# Altium project HU_revC.PrjPcb (part 2 of 4)

## Sheet RPI_CM5_PINOUT.SchDoc
size C; SheetNumber: 3; SheetTotal: 20
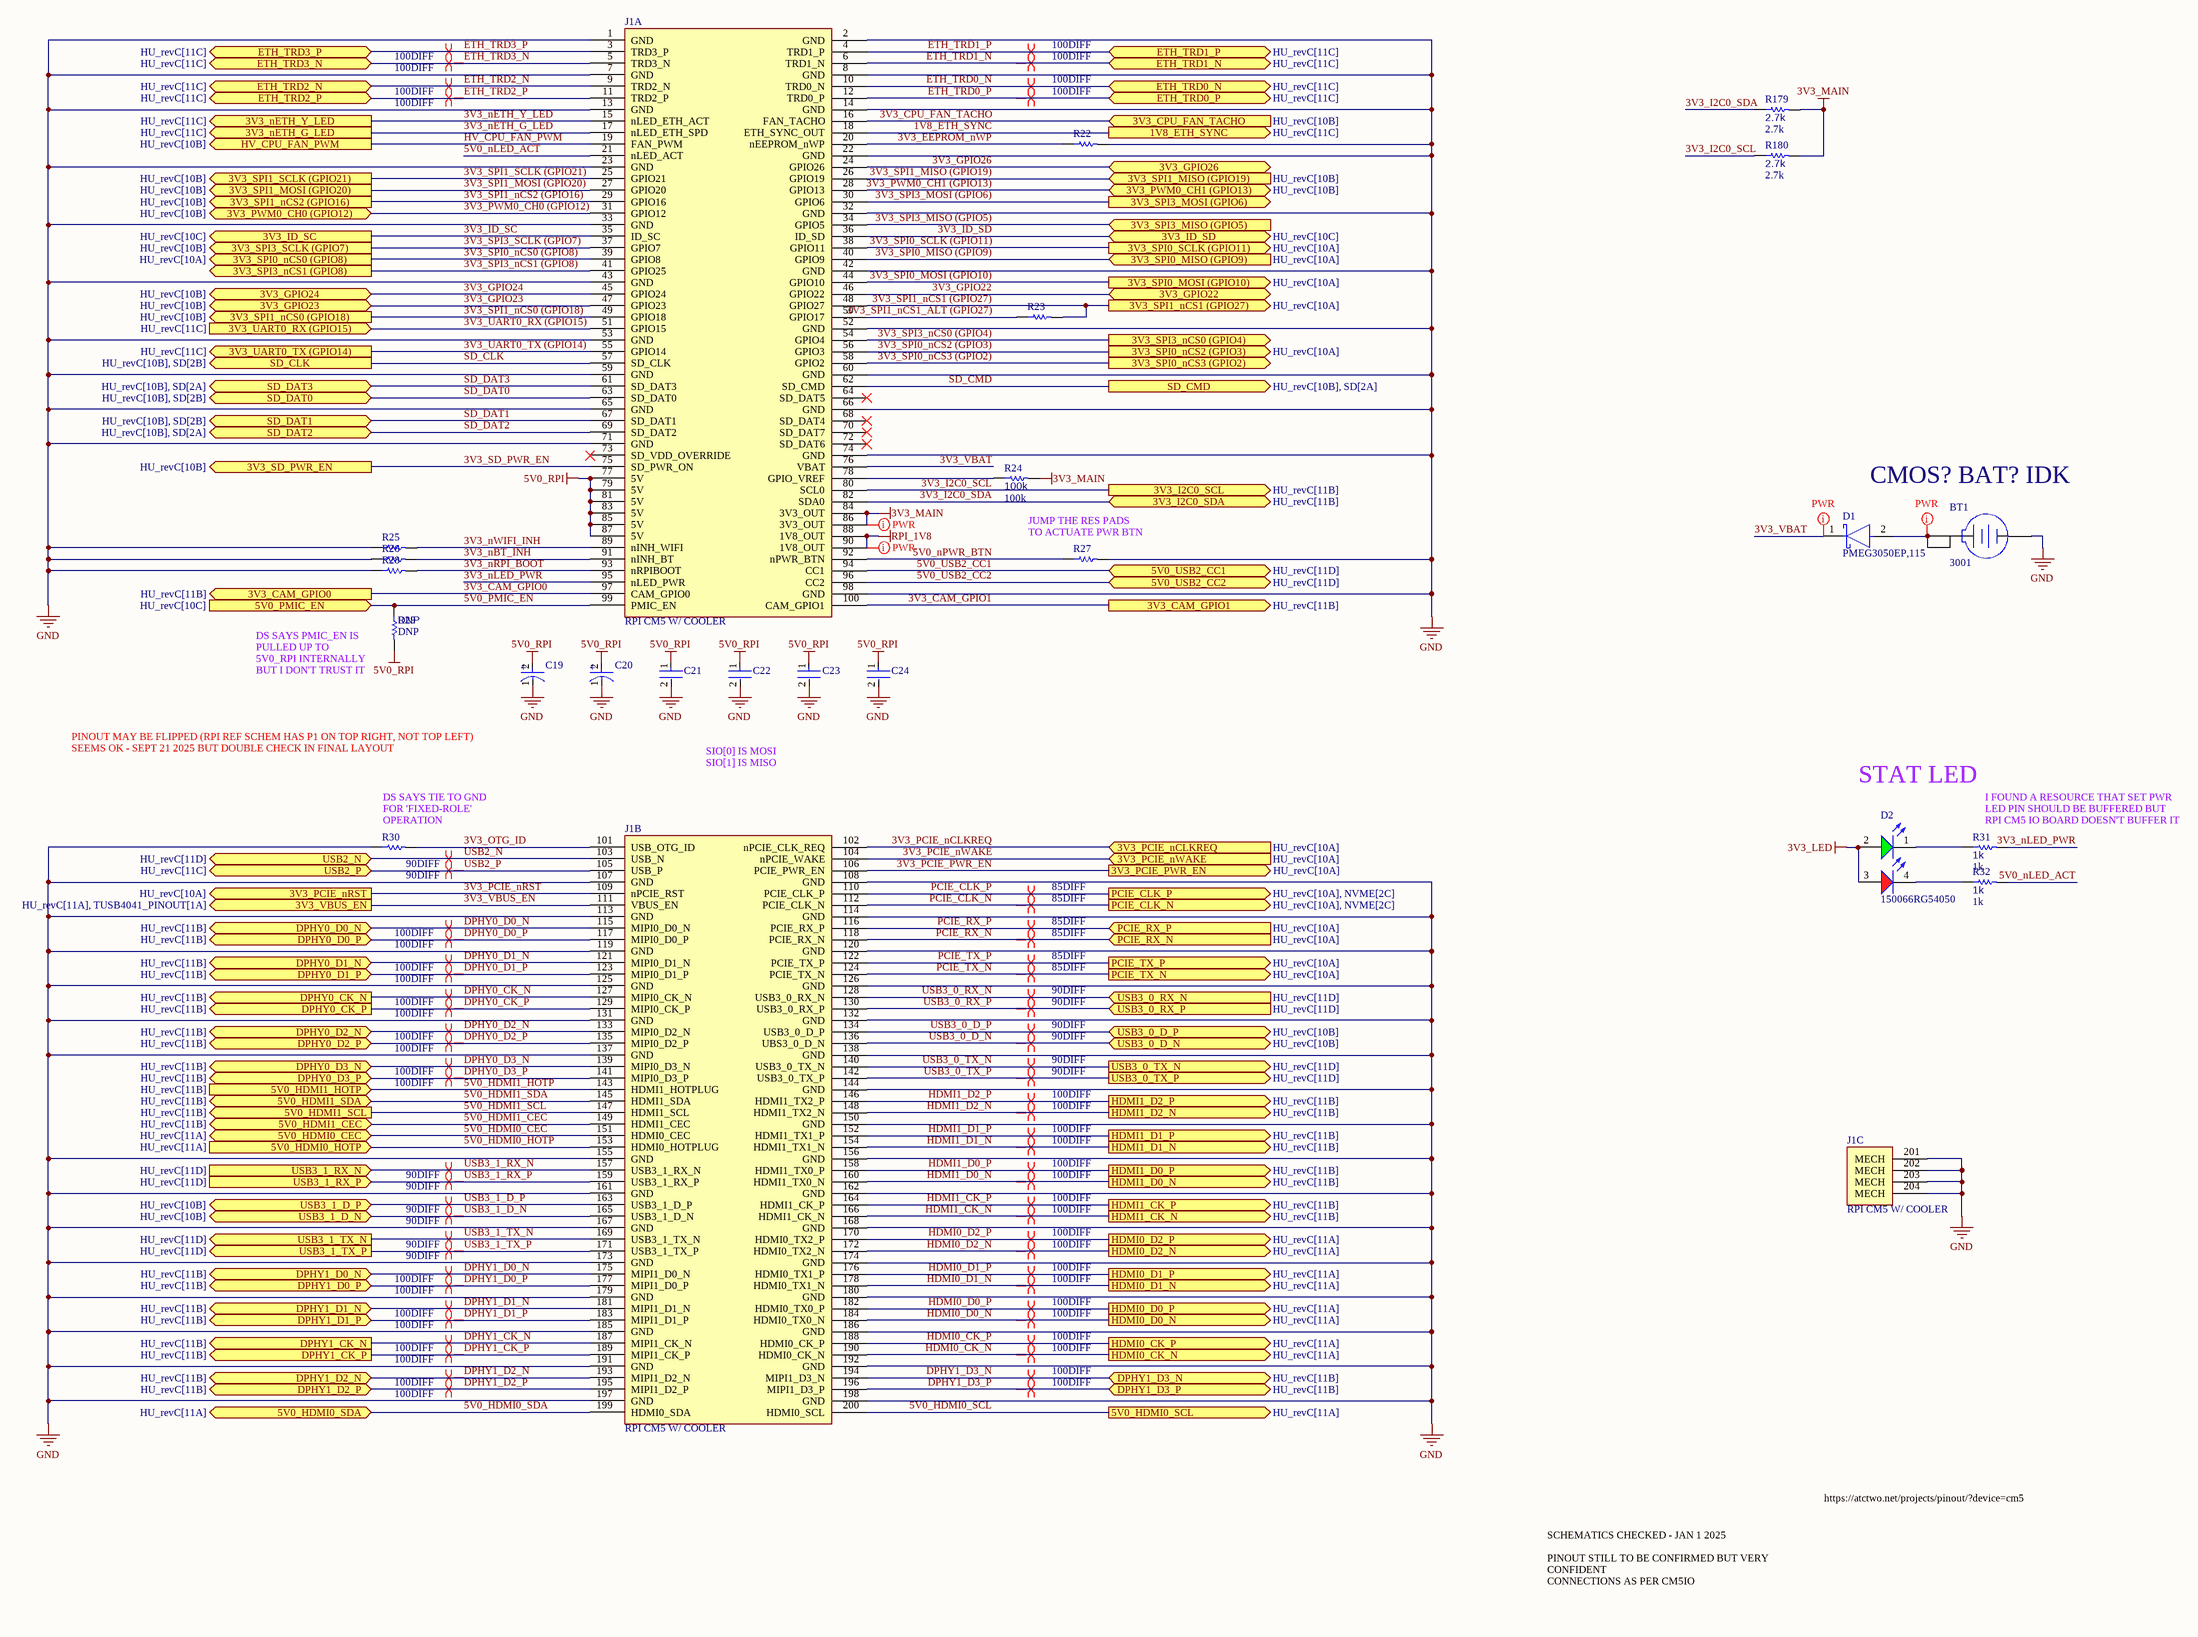
[diagram p7: RPI_CM5_PINOUT.SchDoc]

### Parts
BT1  3001  [KSTN-3001_V]
C19  T491X107K025AT  [FP-T491X107K025AT-MFG]  (value not drawn)
C20  T491X107K025AT  [FP-T491X107K025AT-MFG]  (value not drawn)
C21  C3225X7R1H106M250AC  [FP-C3225-250-0_4-MFG]  (value not drawn)
C22  C3225X7R1H106M250AC  [FP-C3225-250-0_4-MFG]  (value not drawn)
C23  GRM21BR61E226ME44L  [FP-GRM21B-0_2-e0_2_0_7-IPC_B]  (value not drawn)
C24  GRM21BR61E226ME44L  [FP-GRM21B-0_2-e0_2_0_7-IPC_B]  (value not drawn)
D1  PMEG3050EP,115  [FP-SOD128-MFG]
D2  150066RG54050  [WL-SBCD_0606]
J1  RPI CM5 W/ COOLER  [RPI CM5 W_ COOLER-Footprint-1]  (parts A,B,C of 3)
R22  DNP  [RESC1005X40X25ML05T05]  (value not drawn)
R23  DNP  [RESC1005X40X25ML05T05]  (value not drawn)
R24  100k  [R0603B]
R25  DNP  [RESC1005X40X25ML05T05]  (value not drawn)
R26  DNP  [RESC1005X40X25ML05T05]  (value not drawn)
R27  DNP  [RESC1005X40X25ML05T05]  (value not drawn)
R28  DNP  [RESC1005X40X25ML05T05]  (value not drawn)
R29  DNP  [R0603B]
R30  DNP  [RESC1005X40X25ML05T05]  (value not drawn)
R31  1k  [R0603B]
R32  1k  [R0603B]
R179  2.7k  [R0603B]
R180  2.7k  [R0603B]

### Ports
1V8_ETH_SYNC (out, see HU_revC[11C]), 3V3_CAM_GPIO0 (out, see HU_revC[11B]), 3V3_CAM_GPIO1 (out, see HU_revC[11B]), 3V3_CPU_FAN_TACHO (in, see HU_revC[10B]), 3V3_GPIO22 (bidir), 3V3_GPIO23 (bidir, see HU_revC[10B]), 3V3_GPIO24 (bidir, see HU_revC[10B]), 3V3_GPIO26 (bidir), 3V3_I2C0_SCL (out, see HU_revC[11B]), 3V3_I2C0_SDA (bidir, see HU_revC[11B]), 3V3_ID_SC (out, see HU_revC[10C]), 3V3_ID_SD (bidir, see HU_revC[10C]), 3V3_nETH_G_LED (out, see HU_revC[11C]), 3V3_nETH_Y_LED (out, see HU_revC[11C]), 3V3_PCIE_nCLKREQ (in, see HU_revC[10A]), 3V3_PCIE_nRST (out, see HU_revC[10A]), 3V3_PCIE_nWAKE (in, see HU_revC[10A]), 3V3_PCIE_PWR_EN (out, see HU_revC[10A]), 3V3_PWM0_CH0 (GPIO12) (bidir, see HU_revC[10B]), 3V3_PWM0_CH1 (GPIO13) (bidir, see HU_revC[10B]), 3V3_SD_PWR_EN (out, see HU_revC[10B]), 3V3_SPI0_MISO (GPIO9) (in, see HU_revC[10A]), 3V3_SPI0_MOSI (GPIO10) (out, see HU_revC[10A]), 3V3_SPI0_nCS0 (GPIO8) (out, see HU_revC[10A]), 3V3_SPI0_nCS2 (GPIO3) (out, see HU_revC[10A]), 3V3_SPI0_nCS3 (GPIO2) (out), 3V3_SPI0_SCLK (GPIO11) (out, see HU_revC[10A]), 3V3_SPI1_MISO (GPIO19) (in, see HU_revC[10B]), 3V3_SPI1_MOSI (GPIO20) (out, see HU_revC[10B]), 3V3_SPI1_nCS0 (GPIO18) (out, see HU_revC[10B]), 3V3_SPI1_nCS1 (GPIO27) (out, see HU_revC[10A]), 3V3_SPI1_nCS2 (GPIO16) (out, see HU_revC[10B]), 3V3_SPI1_SCLK (GPIO21) (out, see HU_revC[10B]), 3V3_SPI3_MISO (GPIO5) (in), 3V3_SPI3_MOSI (GPIO6) (out), 3V3_SPI3_nCS0 (GPIO4) (out), 3V3_SPI3_nCS1 (GPIO8) (out), 3V3_SPI3_SCLK (GPIO7) (out, see HU_revC[10B]), 3V3_UART0_RX (GPIO15) (in, see HU_revC[11C]), 3V3_UART0_TX (GPIO14) (out, see HU_revC[11C]), 3V3_VBUS_EN (out, see HU_revC[11A], TUSB4041_PINOUT[1A]), 5V0_HDMI0_CEC (bidir, see HU_revC[11A]), 5V0_HDMI0_HOTP (in, see HU_revC[11A]), 5V0_HDMI0_SCL (out, see HU_revC[11A]), 5V0_HDMI0_SDA (bidir, see HU_revC[11A]), 5V0_HDMI1_CEC (bidir, see HU_revC[11B]), 5V0_HDMI1_HOTP (in, see HU_revC[11B]), 5V0_HDMI1_SCL (out, see HU_revC[11B]), 5V0_HDMI1_SDA (bidir, see HU_revC[11B]), 5V0_PMIC_EN (in, see HU_revC[10C]), 5V0_USB2_CC1 (bidir, see HU_revC[11D]), 5V0_USB2_CC2 (bidir, see HU_revC[11D]), DPHY0_CK_N (out, see HU_revC[11B]), DPHY0_CK_P (out, see HU_revC[11B]), DPHY0_D0_N (bidir, see HU_revC[11B]), DPHY0_D0_P (bidir, see HU_revC[11B]), DPHY0_D1_N (bidir, see HU_revC[11B]), DPHY0_D1_P (bidir, see HU_revC[11B]), DPHY0_D2_N (bidir, see HU_revC[11B]), DPHY0_D2_P (bidir, see HU_revC[11B]), DPHY0_D3_N (bidir, see HU_revC[11B]), DPHY0_D3_P (bidir, see HU_revC[11B]), DPHY1_CK_N (out, see HU_revC[11B]), DPHY1_CK_P (out, see HU_revC[11B]), DPHY1_D0_N (bidir, see HU_revC[11B]), DPHY1_D0_P (bidir, see HU_revC[11B]), DPHY1_D1_N (bidir, see HU_revC[11B]), DPHY1_D1_P (bidir, see HU_revC[11B]), DPHY1_D2_N (bidir, see HU_revC[11B]), DPHY1_D2_P (bidir, see HU_revC[11B]), DPHY1_D3_N (bidir, see HU_revC[11B]), DPHY1_D3_P (bidir, see HU_revC[11B]), ETH_TRD0_N (bidir, see HU_revC[11C]), ETH_TRD0_P (bidir, see HU_revC[11C]), ETH_TRD1_N (bidir, see HU_revC[11C]), ETH_TRD1_P (bidir, see HU_revC[11C]), ETH_TRD2_N (bidir, see HU_revC[11C]), ETH_TRD2_P (bidir, see HU_revC[11C]), ETH_TRD3_N (bidir, see HU_revC[11C]), ETH_TRD3_P (bidir, see HU_revC[11C]), HDMI0_CK_N (out, see HU_revC[11A]), HDMI0_CK_P (out, see HU_revC[11A]), HDMI0_D0_N (out, see HU_revC[11A]), HDMI0_D0_P (out, see HU_revC[11A]), HDMI0_D1_N (out, see HU_revC[11A]), HDMI0_D1_P (out, see HU_revC[11A]), HDMI0_D2_N (out, see HU_revC[11A]), HDMI0_D2_P (out, see HU_revC[11A]), HDMI1_CK_N (out, see HU_revC[11B]), HDMI1_CK_P (out, see HU_revC[11B]), HDMI1_D0_N (out, see HU_revC[11B]), HDMI1_D0_P (out, see HU_revC[11B]), HDMI1_D1_N (out, see HU_revC[11B]), HDMI1_D1_P (out, see HU_revC[11B]), HDMI1_D2_N (out, see HU_revC[11B]), HDMI1_D2_P (out, see HU_revC[11B]), HV_CPU_FAN_PWM (out, see HU_revC[10B]), PCIE_CLK_N (out, see HU_revC[10A], NVME[2C]), PCIE_CLK_P (out, see HU_revC[10A], NVME[2C]), PCIE_RX_N (in, see HU_revC[10A]), PCIE_RX_P (in, see HU_revC[10A]), PCIE_TX_N (out, see HU_revC[10A]), PCIE_TX_P (out, see HU_revC[10A]), SD_CLK (out, see HU_revC[10B], SD[2B]), SD_CMD (out, see HU_revC[10B], SD[2A]), SD_DAT0 (bidir, see HU_revC[10B], SD[2B]), SD_DAT1 (bidir, see HU_revC[10B], SD[2B]), SD_DAT2 (bidir, see HU_revC[10B], SD[2A]), SD_DAT3 (bidir, see HU_revC[10B], SD[2A]), USB2_N (bidir, see HU_revC[11D]), USB2_P (bidir, see HU_revC[11C]), USB3_0_D_N (bidir, see HU_revC[10B]), USB3_0_D_P (bidir, see HU_revC[10B]), USB3_0_RX_N (in, see HU_revC[11D]), USB3_0_RX_P (in, see HU_revC[11D]), USB3_0_TX_N (out, see HU_revC[11D]), USB3_0_TX_P (out, see HU_revC[11D]), USB3_1_D_N (bidir, see HU_revC[10B]), USB3_1_D_P (bidir, see HU_revC[10B]), USB3_1_RX_N (in, see HU_revC[11D]), USB3_1_RX_P (in, see HU_revC[11D]), USB3_1_TX_N (out, see HU_revC[11D]), USB3_1_TX_P (out, see HU_revC[11D])

### Nets
3V3_LED: D2.2(A) D2.3(A)
3V3_MAIN: J1.84(3V3_OUT) J1.86(3V3_OUT) R24.2 R179.2 R180.2
5V0_RPI: C19.2(A) C20.2(A) C21.1 C22.1 C23.1 C24.1 J1.77(5V) J1.79(5V) J1.81(5V) J1.83(5V) J1.85(5V) J1.87(5V) R29.2
GND: BT1.3(-) C19.1(C) C20.1(C) C21.2 C22.2 C23.2 C24.2 J1.1(GND) J1.2(GND) J1.7(GND) J1.8(GND) J1.13(GND) J1.14(GND) J1.22(GND) J1.23(GND) J1.32(GND) J1.33(GND) J1.42(GND) J1.43(GND) J1.52(GND) J1.53(GND) J1.59(GND) J1.60(GND) J1.65(GND) J1.66(GND) J1.71(GND) J1.74(GND) J1.98(GND) J1.107(GND) J1.108(GND) J1.113(GND) J1.114(GND) J1.119(GND) J1.120(GND) J1.125(GND) J1.126(GND) J1.131(GND) J1.132(GND) J1.137(GND) J1.138(GND) J1.144(GND) J1.150(GND) J1.155(GND) J1.156(GND) J1.161(GND) J1.162(GND) J1.167(GND) J1.168(GND) J1.173(GND) J1.174(GND) J1.179(GND) J1.180(GND) J1.185(GND) J1.186(GND) J1.191(GND) J1.192(GND) J1.197(GND) J1.198(GND) J1.201(MECH) J1.202(MECH) J1.203(MECH) J1.204(MECH) R22.2 R25.1 R26.1 R27.2 R28.1 R30.1
RPI_1V8: J1.88(1V8_OUT) J1.90(1V8_OUT)
1V8_ETH_SYNC: J1.18(ETH_SYNC_OUT) ; port 1V8_ETH_SYNC
3V3_CAM_GPIO0: J1.97(CAM_GPIO0) ; port 3V3_CAM_GPIO0
3V3_CAM_GPIO1: J1.100(CAM_GPIO1) ; port 3V3_CAM_GPIO1
3V3_CPU_FAN_TACHO: J1.16(FAN_TACHO) ; port 3V3_CPU_FAN_TACHO
3V3_EEPROM_nWP: J1.20(nEEPROM_nWP) R22.1
3V3_GPIO22: J1.46(GPIO22) ; port 3V3_GPIO22
3V3_GPIO23: J1.47(GPIO23) ; port 3V3_GPIO23  [project net 3V3_CAR_VCC_INH]
3V3_GPIO24: J1.45(GPIO24) ; port 3V3_GPIO24
3V3_GPIO26: J1.24(GPIO26) ; port 3V3_GPIO26
3V3_I2C0_SCL: J1.80(SCL0) R180.1 ; port 3V3_I2C0_SCL
3V3_I2C0_SDA: J1.82(SDA0) R179.1 ; port 3V3_I2C0_SDA
3V3_ID_SC: J1.35(ID_SC) ; port 3V3_ID_SC
3V3_ID_SD: J1.36(ID_SD) ; port 3V3_ID_SD
3V3_nBT_INH: J1.91(nINH_BT) R26.2
3V3_nETH_G_LED: J1.17(nLED_ETH_SPD) ; port 3V3_nETH_G_LED
3V3_nETH_Y_LED: J1.15(nLED_ETH_ACT) ; port 3V3_nETH_Y_LED
3V3_nLED_PWR: J1.95(nLED_PWR) R31.2
3V3_nRPI_BOOT: J1.93(nRPIBOOT) R28.2
3V3_nWIFI_INH: J1.89(nINH_WIFI) R25.2
3V3_OTG_ID: J1.101(USB_OTG_ID) R30.2
3V3_PCIE_nCLKREQ: J1.102(nPCIE_CLK_REQ) ; port 3V3_PCIE_nCLKREQ
3V3_PCIE_nRST: J1.109(nPCIE_RST) ; port 3V3_PCIE_nRST
3V3_PCIE_nWAKE: J1.104(nPCIE_WAKE) ; port 3V3_PCIE_nWAKE
3V3_PCIE_PWR_EN: J1.106(PCIE_PWR_EN) ; port 3V3_PCIE_PWR_EN
3V3_PWM0_CH0 (GPIO12): J1.31(GPIO12) ; port 3V3_PWM0_CH0 (GPIO12)
3V3_PWM0_CH1 (GPIO13): J1.28(GPIO13) ; port 3V3_PWM0_CH1 (GPIO13)
3V3_SD_PWR_EN: J1.75(SD_PWR_ON) ; port 3V3_SD_PWR_EN
3V3_SPI0_MISO (GPIO9): J1.40(GPIO9) ; port 3V3_SPI0_MISO (GPIO9)
3V3_SPI0_MOSI (GPIO10): J1.44(GPIO10) ; port 3V3_SPI0_MOSI (GPIO10)
3V3_SPI0_nCS0 (GPIO8): J1.39(GPIO8) ; port 3V3_SPI0_nCS0 (GPIO8)
3V3_SPI0_nCS2 (GPIO3): J1.56(GPIO3) ; port 3V3_SPI0_nCS2 (GPIO3)
3V3_SPI0_nCS3 (GPIO2): J1.58(GPIO2) ; port 3V3_SPI0_nCS3 (GPIO2)  [project net 3V3_AMP_PWR_EN]
3V3_SPI0_SCLK (GPIO11): J1.38(GPIO11) ; port 3V3_SPI0_SCLK (GPIO11)
3V3_SPI1_MISO (GPIO19): J1.26(GPIO19) ; port 3V3_SPI1_MISO (GPIO19)
3V3_SPI1_MOSI (GPIO20): J1.27(GPIO20) ; port 3V3_SPI1_MOSI (GPIO20)
3V3_SPI1_nCS0 (GPIO18): J1.49(GPIO18) ; port 3V3_SPI1_nCS0 (GPIO18)
3V3_SPI1_nCS1 (GPIO27): J1.48(GPIO27) R23.2 ; port 3V3_SPI1_nCS1 (GPIO27)
3V3_SPI1_nCS1_ALT (GPIO27): J1.50(GPIO17) R23.1
3V3_SPI1_nCS2 (GPIO16): J1.29(GPIO16) ; port 3V3_SPI1_nCS2 (GPIO16)
3V3_SPI1_SCLK (GPIO21): J1.25(GPIO21) ; port 3V3_SPI1_SCLK (GPIO21)
3V3_SPI3_MISO (GPIO5): J1.34(GPIO5) ; port 3V3_SPI3_MISO (GPIO5)
3V3_SPI3_MOSI (GPIO6): J1.30(GPIO6) ; port 3V3_SPI3_MOSI (GPIO6)
3V3_SPI3_nCS0 (GPIO4): J1.54(GPIO4) ; port 3V3_SPI3_nCS0 (GPIO4)
3V3_SPI3_nCS1 (GPIO8): J1.41(GPIO25) ; port 3V3_SPI3_nCS1 (GPIO8)
3V3_SPI3_SCLK (GPIO7): J1.37(GPIO7) ; port 3V3_SPI3_SCLK (GPIO7)
3V3_UART0_RX (GPIO15): J1.51(GPIO15) ; port 3V3_UART0_RX (GPIO15)
3V3_UART0_TX (GPIO14): J1.55(GPIO14) ; port 3V3_UART0_TX (GPIO14)
3V3_VBAT: D1.1(C) J1.76(VBAT)
3V3_VBUS_EN: J1.111(VBUS_EN) ; port 3V3_VBUS_EN
5V0_HDMI0_CEC: J1.151(HDMI0_CEC) ; port 5V0_HDMI0_CEC
5V0_HDMI0_HOTP: J1.153(HDMI0_HOTPLUG) ; port 5V0_HDMI0_HOTP
5V0_HDMI0_SCL: J1.200(HDMI0_SCL) ; port 5V0_HDMI0_SCL
5V0_HDMI0_SDA: J1.199(HDMI0_SDA) ; port 5V0_HDMI0_SDA
5V0_HDMI1_CEC: J1.149(HDMI1_CEC) ; port 5V0_HDMI1_CEC
5V0_HDMI1_HOTP: J1.143(HDMI1_HOTPLUG) ; port 5V0_HDMI1_HOTP
5V0_HDMI1_SCL: J1.147(HDMI1_SCL) ; port 5V0_HDMI1_SCL
5V0_HDMI1_SDA: J1.145(HDMI1_SDA) ; port 5V0_HDMI1_SDA
5V0_nLED_ACT: J1.21(nLED_ACT) R32.2
5V0_nPWR_BTN: J1.92(nPWR_BTN) R27.1
5V0_PMIC_EN: J1.99(PMIC_EN) R29.1 ; port 5V0_PMIC_EN
5V0_USB2_CC1: J1.94(CC1) ; port 5V0_USB2_CC1
5V0_USB2_CC2: J1.96(CC2) ; port 5V0_USB2_CC2
DPHY0_CK_N: J1.127(MIPI0_CK_N) ; port DPHY0_CK_N
DPHY0_CK_P: J1.129(MIPI0_CK_P) ; port DPHY0_CK_P
DPHY0_D0_N: J1.115(MIPI0_D0_N) ; port DPHY0_D0_N
DPHY0_D0_P: J1.117(MIPI0_D0_P) ; port DPHY0_D0_P
DPHY0_D1_N: J1.121(MIPI0_D1_N) ; port DPHY0_D1_N
DPHY0_D1_P: J1.123(MIPI0_D1_P) ; port DPHY0_D1_P
DPHY0_D2_N: J1.133(MIPI0_D2_N) ; port DPHY0_D2_N
DPHY0_D2_P: J1.135(MIPI0_D2_P) ; port DPHY0_D2_P
DPHY0_D3_N: J1.139(MIPI0_D3_N) ; port DPHY0_D3_N
DPHY0_D3_P: J1.141(MIPI0_D3_P) ; port DPHY0_D3_P
DPHY1_CK_N: J1.187(MIPI1_CK_N) ; port DPHY1_CK_N
DPHY1_CK_P: J1.189(MIPI1_CK_P) ; port DPHY1_CK_P
DPHY1_D0_N: J1.175(MIPI1_D0_N) ; port DPHY1_D0_N
DPHY1_D0_P: J1.177(MIPI1_D0_P) ; port DPHY1_D0_P
DPHY1_D1_N: J1.181(MIPI1_D1_N) ; port DPHY1_D1_N
DPHY1_D1_P: J1.183(MIPI1_D1_P) ; port DPHY1_D1_P
DPHY1_D2_N: J1.193(MIPI1_D2_N) ; port DPHY1_D2_N
DPHY1_D2_P: J1.195(MIPI1_D2_P) ; port DPHY1_D2_P
DPHY1_D3_N: J1.194(MIPI1_D3_N) ; port DPHY1_D3_N
DPHY1_D3_P: J1.196(MIPI1_D3_P) ; port DPHY1_D3_P
ETH_TRD0_N: J1.10(TRD0_N) ; port ETH_TRD0_N
ETH_TRD0_P: J1.12(TRD0_P) ; port ETH_TRD0_P
ETH_TRD1_N: J1.6(TRD1_N) ; port ETH_TRD1_N
ETH_TRD1_P: J1.4(TRD1_P) ; port ETH_TRD1_P
ETH_TRD2_N: J1.9(TRD2_N) ; port ETH_TRD2_N
ETH_TRD2_P: J1.11(TRD2_P) ; port ETH_TRD2_P
ETH_TRD3_N: J1.5(TRD3_N) ; port ETH_TRD3_N
ETH_TRD3_P: J1.3(TRD3_P) ; port ETH_TRD3_P
HDMI0_CK_N: J1.190(HDMI0_CK_N) ; port HDMI0_CK_N
HDMI0_CK_P: J1.188(HDMI0_CK_P) ; port HDMI0_CK_P
HDMI0_D0_N: J1.184(HDMI0_TX0_N) ; port HDMI0_D0_N
HDMI0_D0_P: J1.182(HDMI0_TX0_P) ; port HDMI0_D0_P
HDMI0_D1_N: J1.178(HDMI0_TX1_N) ; port HDMI0_D1_N
HDMI0_D1_P: J1.176(HDMI0_TX1_P) ; port HDMI0_D1_P
HDMI0_D2_N: J1.172(HDMI0_TX2_N) ; port HDMI0_D2_N
HDMI0_D2_P: J1.170(HDMI0_TX2_P) ; port HDMI0_D2_P
HDMI1_CK_N: J1.166(HDMI1_CK_N) ; port HDMI1_CK_N
HDMI1_CK_P: J1.164(HDMI1_CK_P) ; port HDMI1_CK_P
HDMI1_D0_N: J1.160(HDMI1_TX0_N) ; port HDMI1_D0_N
HDMI1_D0_P: J1.158(HDMI1_TX0_P) ; port HDMI1_D0_P
HDMI1_D1_N: J1.154(HDMI1_TX1_N) ; port HDMI1_D1_N
HDMI1_D1_P: J1.152(HDMI1_TX1_P) ; port HDMI1_D1_P
HDMI1_D2_N: J1.148(HDMI1_TX2_N) ; port HDMI1_D2_N
HDMI1_D2_P: J1.146(HDMI1_TX2_P) ; port HDMI1_D2_P
HV_CPU_FAN_PWM: J1.19(FAN_PWM) ; port HV_CPU_FAN_PWM
PCIE_CLK_N: J1.112(PCIE_CLK_N) ; port PCIE_CLK_N
PCIE_CLK_P: J1.110(PCIE_CLK_P) ; port PCIE_CLK_P
PCIE_RX_N: J1.118(PCIE_RX_N) ; port PCIE_RX_N
PCIE_RX_P: J1.116(PCIE_RX_P) ; port PCIE_RX_P
PCIE_TX_N: J1.124(PCIE_TX_N) ; port PCIE_TX_N
PCIE_TX_P: J1.122(PCIE_TX_P) ; port PCIE_TX_P
SD_CLK: J1.57(SD_CLK) ; port SD_CLK
SD_CMD: J1.62(SD_CMD) ; port SD_CMD
SD_DAT0: J1.63(SD_DAT0) ; port SD_DAT0
SD_DAT1: J1.67(SD_DAT1) ; port SD_DAT1
SD_DAT2: J1.69(SD_DAT2) ; port SD_DAT2
SD_DAT3: J1.61(SD_DAT3) ; port SD_DAT3
USB2_N: J1.103(USB_N) ; port USB2_N  [project net PRE_RC_DBG_USB_N]
USB2_P: J1.105(USB_P) ; port USB2_P  [project net PRE_RC_DBG_USB_P]
USB3_0_D_N: J1.136(UBS3_0_D_N) ; port USB3_0_D_N
USB3_0_D_P: J1.134(USB3_0_D_P) ; port USB3_0_D_P
USB3_0_RX_N: J1.128(USB3_0_RX_N) ; port USB3_0_RX_N
USB3_0_RX_P: J1.130(USB3_0_RX_P) ; port USB3_0_RX_P
USB3_0_TX_N: J1.140(USB3_0_TX_N) ; port USB3_0_TX_N
USB3_0_TX_P: J1.142(USB3_0_TX_P) ; port USB3_0_TX_P
USB3_1_D_N: J1.165(USB3_1_D_N) ; port USB3_1_D_N
USB3_1_D_P: J1.163(USB3_1_D_P) ; port USB3_1_D_P
USB3_1_RX_N: J1.157(USB3_1_RX_N) ; port USB3_1_RX_N
USB3_1_RX_P: J1.159(USB3_1_RX_P) ; port USB3_1_RX_P
USB3_1_TX_N: J1.169(USB3_1_TX_N) ; port USB3_1_TX_N
USB3_1_TX_P: J1.171(USB3_1_TX_P) ; port USB3_1_TX_P
NetBT1_1: BT1.1(+) BT1.2(+) D1.2(A)
NetD2_1: D2.1(K) R31.1
NetD2_4: D2.4(K) R32.1
NetJ1_78: J1.78(GPIO_VREF) R24.1

Not connected (* = marked no-connect by the designer): J1 64(SD_DAT5)* 68(SD_DAT4)* 70(SD_DAT7)* 72(SD_DAT6)* 73(SD_VDD_OVERRIDE)*

### Layout directives
net class PWR: 3V3_MAIN, 3V3_VBAT, NetBT1_1, RPI_1V8
differential pair; differential pair class 100DIFF: DPHY0_CK_N, DPHY0_CK_P, DPHY0_D0_N, DPHY0_D0_P, DPHY0_D1_N, DPHY0_D1_P, DPHY0_D2_N, DPHY0_D2_P, DPHY0_D3_N, DPHY0_D3_P, DPHY1_CK_N, DPHY1_CK_P, DPHY1_D0_N, DPHY1_D0_P, DPHY1_D1_N, DPHY1_D1_P, DPHY1_D2_N, DPHY1_D2_P, DPHY1_D3_N, DPHY1_D3_P, ETH_TRD0_N, ETH_TRD0_P, ETH_TRD1_N, ETH_TRD1_P, ETH_TRD2_N, ETH_TRD2_P, ETH_TRD3_N, ETH_TRD3_P, HDMI0_CK_N, HDMI0_CK_P, HDMI0_D0_N, HDMI0_D0_P, HDMI0_D1_N, HDMI0_D1_P, HDMI0_D2_N, HDMI0_D2_P, HDMI1_CK_N, HDMI1_CK_P, HDMI1_D0_N, HDMI1_D0_P, HDMI1_D1_N, HDMI1_D1_P, HDMI1_D2_N, HDMI1_D2_P
differential pair; differential pair class 90DIFF: PRE_RC_DBG_USB_N, PRE_RC_DBG_USB_P, USB3_0_D_N, USB3_0_D_P, USB3_0_RX_N, USB3_0_RX_P, USB3_0_TX_N, USB3_0_TX_P, USB3_1_D_N, USB3_1_D_P, USB3_1_RX_N, USB3_1_RX_P, USB3_1_TX_N, USB3_1_TX_P
differential pair; differential pair class 85DIFF: PCIE_CLK_N, PCIE_CLK_P, PCIE_RX_N, PCIE_RX_P, PCIE_TX_N, PCIE_TX_P

### Notes on the sheet
- CMOS? BAT? IDK
- JUMP THE RES PADS TO ACTUATE PWR BTN
- (near R29) DS SAYS PMIC_EN IS PULLED UP TO 5V0_RPI INTERNALLY BUT I DON'T TRUST IT
- PINOUT MAY BE FLIPPED (RPI REF SCHEM HAS P1 ON TOP RIGHT, NOT TOP LEFT)
- SEEMS OK - SEPT 21 2025 BUT DOUBLE CHECK IN FINAL LAYOUT
- SIO[0] IS MOSI
  SIO[1] IS MISO
- STAT LED
- (near R30) DS SAYS TIE TO GND FOR 'FIXED-ROLE' OPERATION
- (near R31) I FOUND A RESOURCE THAT SET PWR LED PIN SHOULD BE BUFFERED BUT RPI CM5 IO BOARD DOESN'T BUFFER IT
- https://atctwo.net/projects/pinout/?device=cm5
- SCHEMATICS CHECKED - JAN 1 2025
  PINOUT STILL TO BE CONFIRMED BUT VERY CONFIDENT
  CONNECTIONS AS PER CM5IO
- (in symbol CMP-2000-07204-2) +

### Library data of the parts
BT1 = CMP-2000-05463-1: Holder Battery Coin, 12 mm, 2-Pin THD, RoHS; Manufacturer: Keystone; Package Reference: 3001; Package Description: 2-Pin Through Hole Device, Body 13.21 x 12.07 mm; Datasheet Version: Rev. H, 09/2006; Datasheet URL: https://datasheet.ciiva.com/3/3001-3954.pdf; Mounting Technology: ThroughHole; Manufacturer URL: http://www.keyelco.com/
C19 C20 = CMP-2000-07204-2: CAP TANT 100UF 10% 25V 2917; Leakage Current: 25uA; Ripple Current: 742mA; Polarity: Polar; Dissipation Factor: 8%; Life (Hours): 2000Hour; Dielectric Material: Tantalum; ESR (Equivalent Series Resistance): 300mR; Length: 7.3mm; RoHS Compliant: No; Failure Rate: 0.001%; REACH SVHC: No SVHC; Tolerance: 10%; Mount: Surface Mount; Height - Seated (Max): 0.169inch; Features: General Purpose; Height: 4mm; Package Quantity: 1; Case Code (Metric): 7343; Max Operating Temperature: 125°C; Number of Pins: 2; Radiation Hardening: No; Lead Free: Lead Free; Capacitance: 100uF; Termination: SMD/SMT; Voltage Rating: 25V; Series: T491; Depth: 4.3mm; Construction: Flat; Case/Package: 2917; Min Operating Temperature: -55°C; Voltage Rating (DC): 25V; Width: 4.3mm; Packaging: Tape and Reel; Case Code (Imperial): 2917; Voltage: 25V
C21 C22 = CMP-08246-002653-1: Multilayer Ceramic Capacitors 10uF ±20% 50V X7R SMD 1210; Width: 0.098inch; Package Quantity: 1000; Height: 2.5mm; Dielectric Material: Ceramic; Voltage Rating: 50V; Series: C; Capacitance: 10uF; Tolerance: 20%; Weight: 0.000564oz; Case/Package: 1210; Case Code (Imperial): 1210; Dielectric: X7R; Case Code (Metric): 3225; REACH SVHC: No SVHC; Packaging: Tape and Reel; Length: 0.126inch; Termination: SMD/SMT; Min Operating Temperature: -55°C; Voltage Rating (DC): 50V; Lead Free: Lead Free; Max Operating Temperature: 125°C; Thickness: 0.11inch; Mount: Surface Mount
C23 C24 = CMP-2007-03222-3: Chip Multilayer Ceramic Capacitors for General Purpose, 0805, 22uF, X5R, 15%, 20%, 25V; Case/Package: 0805; Depth: 1.25mm; Resistor Type: Ceramic; Voltage Rating: 25V; Lead Free: Lead Free; Voltage Rating (DC): 25V; Case Code (Metric): 2012; Thickness: 0.057inch; REACH SVHC: No SVHC; Material: Ceramic; Tolerance: 20%; Length: 2mm; Capacitance: 22uF; Case Code (Imperial): 0805; Max Operating Temperature: 85°C; Termination: SMD/SMT; Weight: 0.000335oz; Dielectric: X5R; Packaging: Tape and Reel; Voltage: 25V; Package Quantity: 3000; Height: 1.25mm; Mount: Surface Mount; Width: 1.25mm; Min Operating Temperature: -55°C
D1 = CMP-14398-000051-1: DIODE SCHOTTKY 30V 5A SOD128; RoHS Compliant: Yes
D2 = CMP-004-00040-2: Led, Red/Grn, 180Mcd/230Mcd, 624Nm/525Nm Rohs Compliant: Yes; Source: rgled.SchLib; Component Type: Standard; Pins: 4; Design Item ID: CMP-004-00034-2
J1 = CMP-00028-00005-4: Mechanical placeholder for RPI CM5 w/ active cooler on it
R22 R23 R25-R28 R30 = CMP-009-00118-2: READ THE NAME; Pins: 2; Component Type: Standard; Design Item ID: CMP-009-00206-2; Source: 0402jump.SchLib
R24 R29 R31 R32 R179 R180 = CMP-009-00002-14: Resistor
  R24: Value: 100k
  R29: Value: DNP
  R31 R32: Value: 1k
  R179 R180: Value: 2.7k

## Sheet 5V0_REG.SchDoc
size C; SheetNumber: 4; SheetTotal: 20
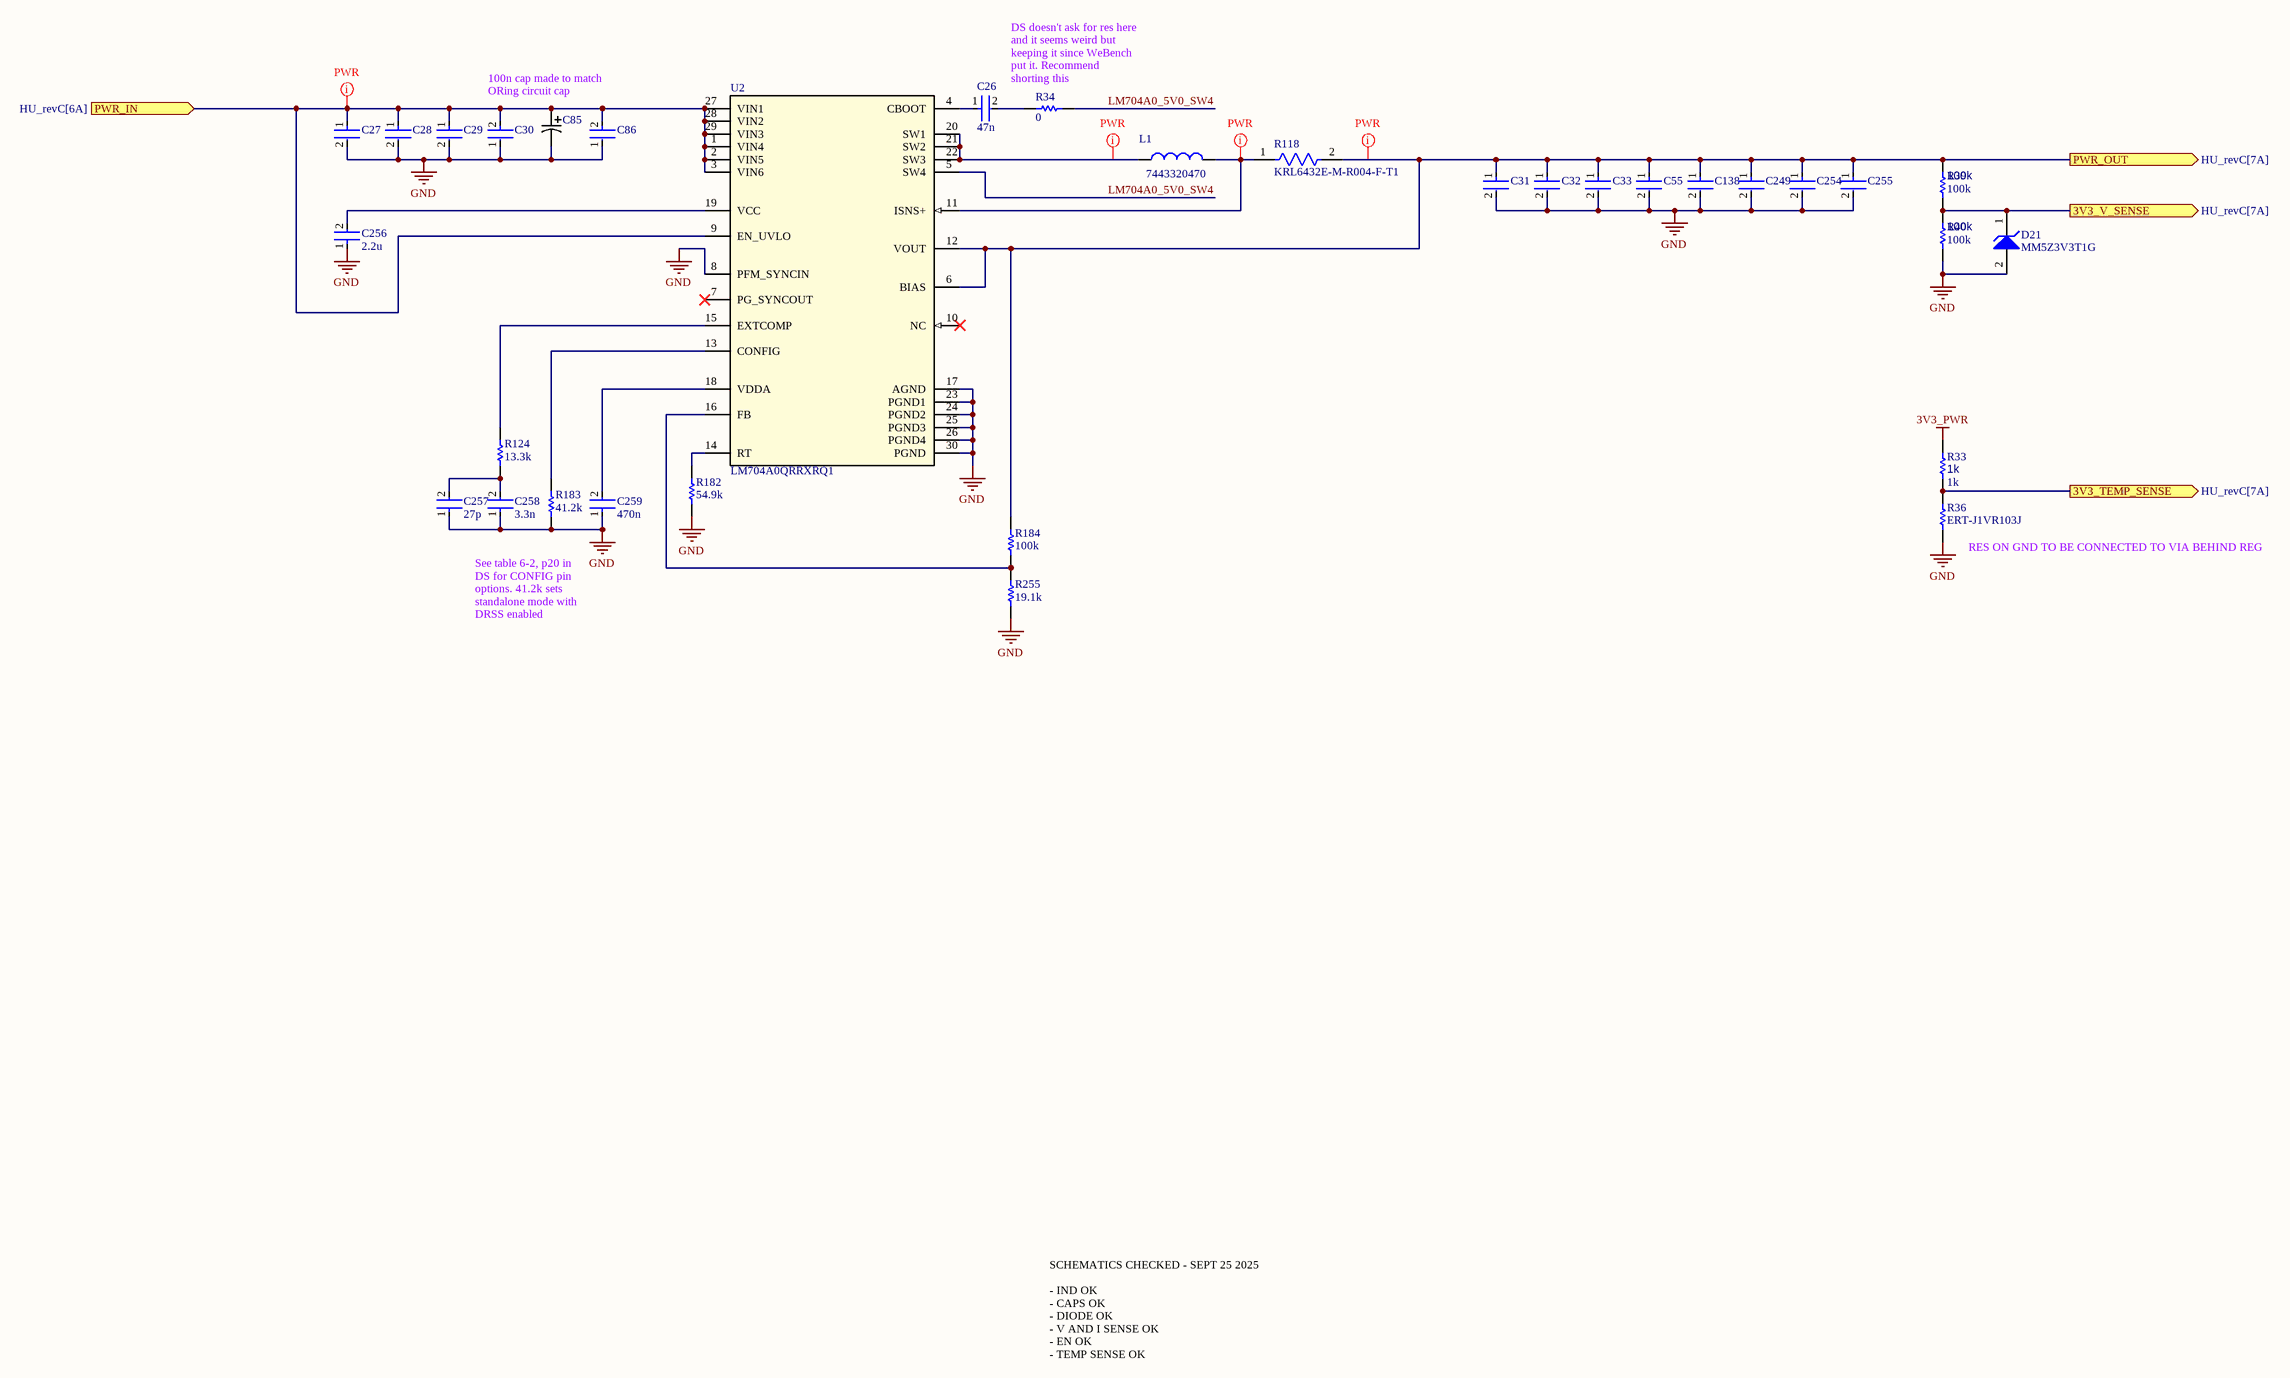
[diagram p8: 5V0_REG.SchDoc]

### Parts
C26  47n  [FP-0402-L_1_0_0_05-W_0_5-IPC_A]
C27  C3225X7R1H106M250AC  [FP-C3225-250-0_4-MFG]  (value not drawn)
C28  C3225X7R1H106M250AC  [FP-C3225-250-0_4-MFG]  (value not drawn)
C29  C3225X7R1H106M250AC  [FP-C3225-250-0_4-MFG]  (value not drawn)
C30  AC1210KKX7R0BB104  [FP-AC1210-0_85-MFG]  (value not drawn)
C31  GRM32ER61C476KE15L  [FP-GRM32E-0_3-0_2-IPC_C]  (value not drawn)
C32  GRM32ER61C476KE15L  [FP-GRM32E-0_3-0_2-IPC_C]  (value not drawn)
C33  GRM32ER61C476KE15L  [FP-GRM32E-0_3-0_2-IPC_C]  (value not drawn)
C55  GRM32ER61C476KE15L  [FP-GRM32E-0_3-0_2-IPC_C]  (value not drawn)
C85  DNP  [T495D337K010ATE150-Footprint-1]  (value not drawn)
C86  AC1210KKX7R0BB104  [FP-AC1210-0_85-MFG]  (value not drawn)
C138  GRM32ER61C476KE15L  [FP-GRM32E-0_3-0_2-IPC_C]  (value not drawn)
C249  GRM32ER61C476KE15L  [FP-GRM32E-0_3-0_2-IPC_C]  (value not drawn)
C254  GRM32ER61C476KE15L  [FP-GRM32E-0_3-0_2-IPC_C]  (value not drawn)
C255  GRM32ER61C476KE15L  [FP-GRM32E-0_3-0_2-IPC_C]  (value not drawn)
C256  2.2u  [FP-0402-L_1_0_0_05-W_0_5-IPC_A]
C257  27p  [FP-0402-L_1_0_0_05-W_0_5-IPC_A]
C258  3.3n  [FP-0402-L_1_0_0_05-W_0_5-IPC_A]
C259  470n  [FP-0402-L_1_0_0_05-W_0_5-IPC_A]
D21  MM5Z3V3T1G  [ONSC-SOD-523-2-502-01_V]
L1  7443320470  [WE-HCC_1210]
R33  1k  [R0603B]
R34  0  [R0603B]
R36  ERT-J1VR103J  [RESC1608X90X30ML15T20]
R39  100k  [R0603B]
R40  100k  [R0603B]
R118  KRL6432E-M-R004-F-T1  [FP-KRL6432E-MFG]
R124  13.3k  [R0603B]
R182  54.9k  [R0603B]
R183  41.2k  [R0603B]
R184  100k  [R0603B]
R255  19.1k  [R0603B]
U2  LM704A0QRRXRQ1  [LM704A0QRRXRQ1-Footprint-1]

### Ports
3V3_TEMP_SENSE (out, see HU_revC[7A]), 3V3_V_SENSE (out, see HU_revC[7A]), PWR_IN (in, see HU_revC[6A]), PWR_OUT (out, see HU_revC[7A])

### Nets
3V3_PWR: R33.1
5V0_MAIN: C31.1 C32.1 C33.1 C55.1 C138.1 C249.1 C254.1 C255.1 R39.2 R118.2 R184.1 U2.6(BIAS) U2.12(VOUT) ; port PWR_OUT
GND: C27.2 C28.2 C29.2 C30.1 C31.2 C32.2 C33.2 C55.2 C85.2 C86.1 C138.2 C249.2 C254.2 C255.2 C256.1 C257.1 C258.1 C259.1 D21.2(A) R36.1 R40.1 R182.2 R183.2 R255.2 U2.8(PFM_SYNCIN) U2.17(AGND) U2.23(PGND1) U2.24(PGND2) U2.25(PGND3) U2.26(PGND4) U2.30(PGND)
3V3_5V0_MAIN_T_SENSE: R33.2 R36.2 ; port 3V3_TEMP_SENSE
3V3_5V0_MAIN_V_SENSE: D21.1(K) R39.1 R40.2 ; port 3V3_V_SENSE
LM704A0_5V0_SW4: R34.2 U2.5(SW4)
NetC26_1: C26.1 U2.4(CBOOT)
NetC26_2: C26.2 R34.1
NetC27_1: C27.1 C28.1 C29.1 C30.2 C85.1 C86.2 U2.1(VIN4) U2.2(VIN5) U2.3(VIN6) U2.9(EN_UVLO) U2.27(VIN1) U2.28(VIN2) U2.29(VIN3) ; port PWR_IN
NetC256_2: C256.2 U2.19(VCC)
NetC257_2: C257.2 C258.2 R124.1
NetC259_2: C259.2 U2.18(VDDA)
NetL1_1: L1.1 U2.20(SW1) U2.21(SW2) U2.22(SW3)
NetL1_2: L1.2 R118.1 U2.11(ISNS+)
NetR124_2: R124.2 U2.15(EXTCOMP)
NetR182_1: R182.1 U2.14(RT)
NetR183_1: R183.1 U2.13(CONFIG)
NetR184_2: R184.2 R255.1 U2.16(FB)

Not connected (* = marked no-connect by the designer): U2 7(PG_SYNCOUT)* 10(NC)*

### Layout directives
net class PWR: 5V0_MAIN, NetC27_1, NetL1_1, NetL1_2

### Notes on the sheet
- 100n cap made to match ORing circuit cap
- DS doesn't ask for res here and it seems weird but keeping it since WeBench put it. Recommend shorting this
- (near R36) RES ON GND TO BE CONNECTED TO VIA BEHIND REG
- See table 6-2, p20 in DS for CONFIG pin options. 41.2k sets standalone mode with DRSS enabled
- SCHEMATICS CHECKED - SEPT 25 2025
  - IND OK
  - CAPS OK
  - DIODE OK
  - V AND I SENSE OK
  - EN OK
  - TEMP SENSE OK

### Library data of the parts
C26 C256-C259 = CMP-001-00058-1: LARGE PADS, 0402 CAP, CHANGE COMMENT TO MATCH REAL P/N; Capacitor Type: Ceramic; Min Operating Temperature: -55°C; Mounting Technology: Surface Mount; Pins: 2; Case/Package: 0402; RoHS Compliant: Yes; Max Operating Temperature: 85°C
C27-C29 = CMP-08246-002653-1: as C21 on sheet RPI_CM5_PINOUT; Width: 0.098inch; Package Quantity: 1000; Height: 2.5mm; Dielectric Material: Ceramic; Voltage Rating: 50V; Series: C; Capacitance: 10uF; Tolerance: 20%; Weight: 0.000564oz; Case/Package: 1210; Case Code (Imperial): 1210; Dielectric: X7R; Case Code (Metric): 3225; REACH SVHC: No SVHC; Packaging: Tape and Reel; Length: 0.126inch; Termination: SMD/SMT; Min Operating Temperature: -55°C; Voltage Rating (DC): 50V; Lead Free: Lead Free; Max Operating Temperature: 125°C; Thickness: 0.11inch; Mount: Surface Mount
C30 C86 = CMP-03422-000642-1: CAP CER 0.1UF 100V X7R 1210; Manufacturer: Yageo; Automotive Grade: Grade 1; Capacitance: 100 nF; Material: Ceramic; Value: 100 nF; Temperature Coefficient: 15%; Tolerance: 0.1; Automotive: Yes; ComponentLink2Description: Datasheet; Device Class L2: Capacitors; Height: 0.95mm; Manufacturer Part Number: AC1210KKX7R0BB104; Temperature: -55°C to +125°C; Voltage Rating: 100 V; Device Class L1: Passive Components; ComponentLink2URL: http://www.yageo.com/documents/recent/UPY-AC_NP0X7R_16V-to-630V_12.pdf; Lead Free: Yes; Category: Cap; Temperature Range High: +125°C; RoHS: TRUE; Digikey Description: CAP CER 0.1UF 100V X7R 1210; Temperature Range Low: -55°C; Octopart: https://octopart.com/ac1210kkx7r0bb104-yageo-78873719; Device Class L3: Ceramic Capacitors; Ipc Land Pattern Name: CAPC320250X85; Package: AC1210-0.85; Footprint Url: http://www.yageo.com/exep/pages/download/literatures/UPY-C_GEN_24.pdf; Temperature Characteristic: X7R
C31-C33 C55 C138 C249 C254 C255 = CMP-2000-06362-2: CAP CER 47UF 16V X5R 1210; Tolerance: 10%; Material: Ceramic; Case Code (Metric): 3225; RoHS Compliant: Yes; Min Operating Temperature: -55°C; Radiation Hardening: No; Voltage: 16V; Package Quantity: 1; Case Code (Imperial): 1210; REACH SVHC: No SVHC; Capacitance: 47uF; Voltage Rating (DC): 16V; Dielectric: X5R; Case/Package: 1210; Length: 3.2mm; Voltage Rating: 16V; Packaging: Cut Tape; Width: 0.098inch; Number of Pins: 2; Lead Free: Lead Free; Height: 2.5mm; Mount: Surface Mount; Termination: SMD/SMT; Max Operating Temperature: 85°C; Thickness: 0.106inch; Depth: 2.5mm
C85 = CMP-001-00067-2: T495X107K020ATE150 diff p/n; Tolerance: 10%; Voltage Rating: 10V; Value: 330µF; Case/Package: 2917; Min Operating Temperature: -55°C; Mounting Technology: Surface Mount; Max Operating Temperature: 125°C
D21 = CMP-1060-00750-1: Zener Voltage Regulator, 500 mW, 2-Pin SOD-523, Pb-Free, Tape and Reel; Manufacturer: On Semiconductor; P Max (W): 0.5; VZ Typ (V): 3.3; RoHS: Pb-Free; ComponentLink2Description: Datasheet; PackageReference: SOD-523-2-502-01; DatasheetVersion: Rev. 10; ComponentLink1Description: Manufacturer URL; PackageVersion: Rev. E, 09/2010; ComponentLink3URL: http://www.onsemi.com/pub_link/Collateral/502-01.PDF; ComponentLink2URL: http://www.onsemi.cn/pub_link/Collateral/MM5Z2V4T1-D.PDF; Mounting Technology: Surface Mount; PartNumber: MM5Z3V3T1G; Packing: Tape and Reel; PackageDescription: 2-Pin SOD, Body 1.2 x 0.8 mm; ComponentLink1URL: http://www.onsemi.com/; ComponentLink3Description: Package Specification
L1 = CMP-0226-00121-3: We-hcc Series, Shielded Wire-wound SMD Inductor With Ferrite Core, 4.7 Uh; Inductance Tolerance: 20%; Self Resonant Frequency: 43MHz; Saturation Current: 15.6A; Current Rating: 15.5A; Inductance: 4.7µH; DC Resistance (DCR): 7.25mΩ; Width: 11.4mm; Core Material: Ferrite; Number of Pins: 2; Material: Ferrite; RoHS: Compliant; Length: 12.1mm; Max Operating Temperature: 125°C; Ambient Temperature Range Low: -40°C; Min Operating Temperature: -40°C; Height: 9.5mm; Ambient Temperature Range High: 75°C
R33 R34 R39 R40 R124 R182-R184 R255 = CMP-009-00002-14: Resistor
  R33: Value: 1k
  R39 R40: Value: 100k
R36 = CMP-2000-00869-1: Manufacturer: Panasonic; Part Number: ERT-J1VR103J
R118 = CMP-00597-24927457-1: KRL6432E-M-R004-F-T1 Metal Foil Low Resistance Chip Resistor (long-side terminal), 2512, RoHS; Power Rating: 3W; Temperature Coefficient: 50ppm/°C; Tolerance: 1%; Resistance: 4mΩ; Length: 3.1mm; Composition: Metal Foil; Termination: SMD/SMT; Max Operating Temperature: 155°C; Case Code (Imperial): 2512; NexarPartId: 24927457; Width: 6.3mm; Max Power Dissipation: 3W; Case Code (Metric): 6432; Min Operating Temperature: -55°C; Packaging: Digi-Reel®; Max Thickness: 700µm; Lifecycle Status: Production; Height: 700µm; Weight: 40.511469mg; Case/Package: 2512; RoHS: Compliant; Number of Terminations: 2
U2 = CMP-019-00058-1: Automotive, High-density, 4.5V to 45V input, 10A low-EMI synchronous DC/DC step-down converter 29-VQFN -40 to 150; Case/Package: VQFN; Pins: 29

## Sheet NVME.SchDoc
size C; SheetNumber: 5; SheetTotal: 21
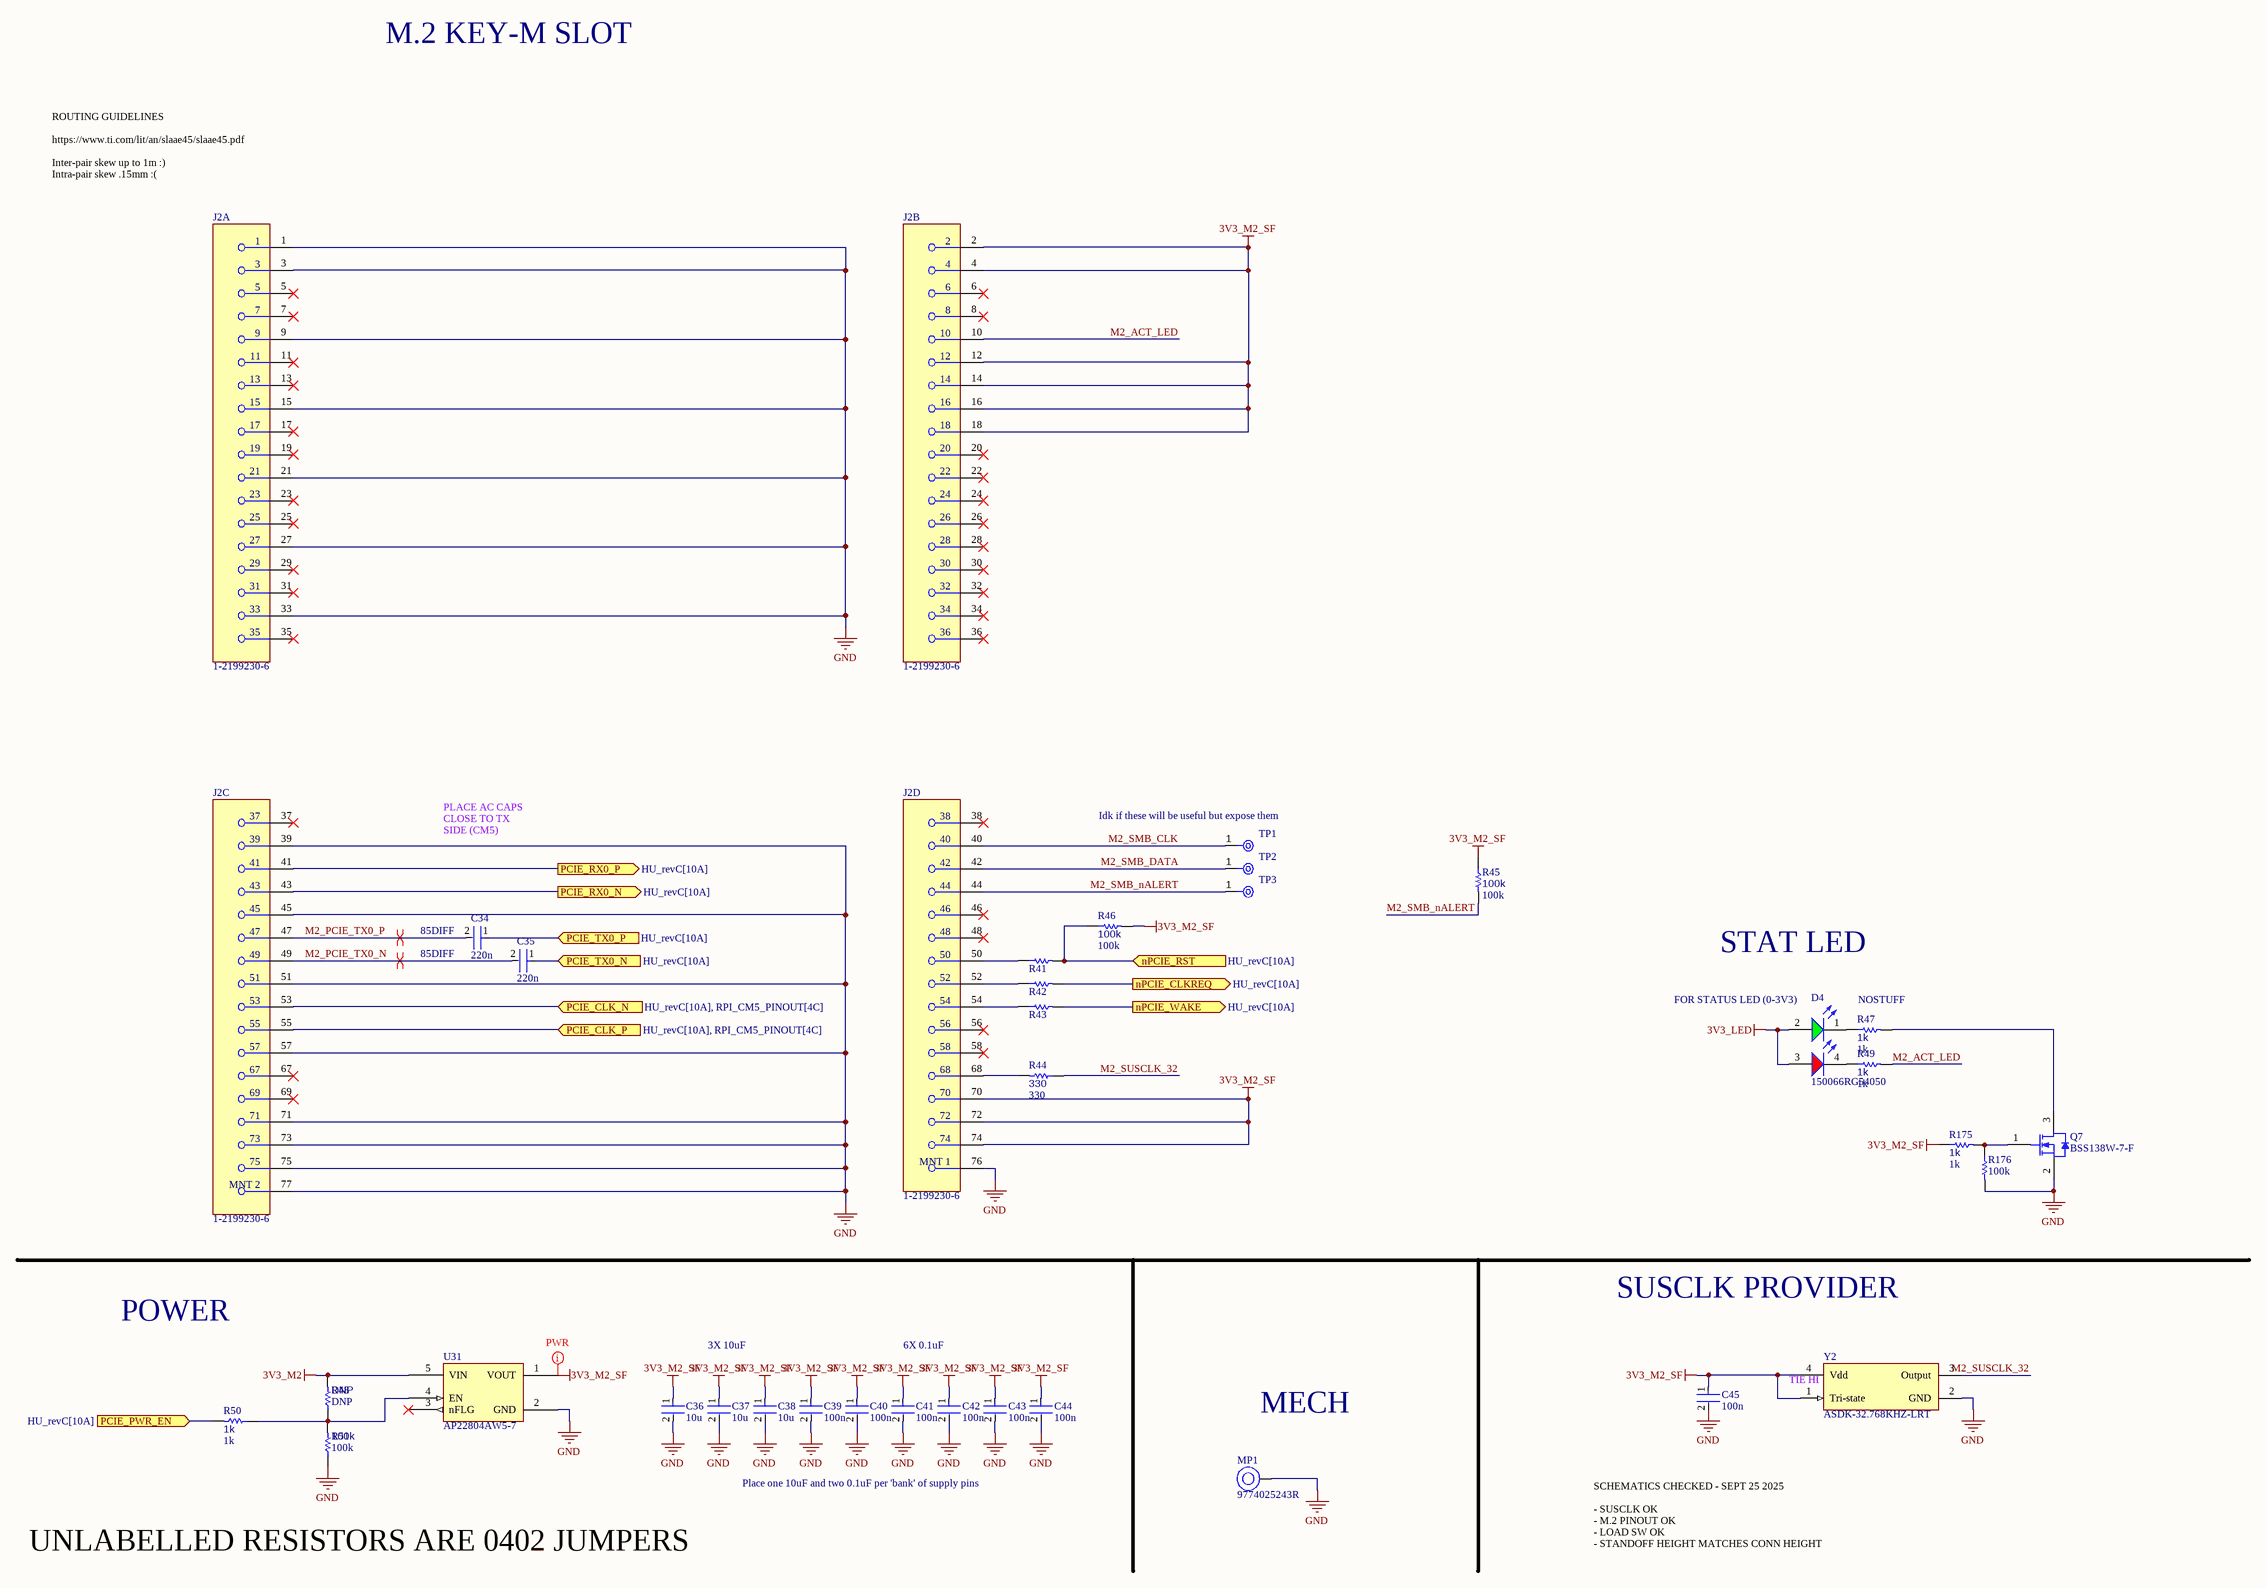
[diagram p9: NVME.SchDoc]

### Parts
C34  220n  [FP-0402-L_1_0_0_05-W_0_5-IPC_A]
C35  220n  [FP-0402-L_1_0_0_05-W_0_5-IPC_A]
C36  10u  [FP-0402-L_1_0_0_05-W_0_5-IPC_A]
C37  10u  [FP-0402-L_1_0_0_05-W_0_5-IPC_A]
C38  10u  [FP-0402-L_1_0_0_05-W_0_5-IPC_A]
C39  100n  [FP-0402-L_1_0_0_05-W_0_5-IPC_A]
C40  100n  [FP-0402-L_1_0_0_05-W_0_5-IPC_A]
C41  100n  [FP-0402-L_1_0_0_05-W_0_5-IPC_A]
C42  100n  [FP-0402-L_1_0_0_05-W_0_5-IPC_A]
C43  100n  [FP-0402-L_1_0_0_05-W_0_5-IPC_A]
C44  100n  [FP-0402-L_1_0_0_05-W_0_5-IPC_A]
C45  100n  [FP-0402-L_1_0_0_05-W_0_5-IPC_A]
D4  150066RG54050  [WL-SBCD_0606]
J2  1-2199230-6  [FP-1-2199230-6-MFG]  (parts A,B,C,D of 4)
MP1  9774025243R  [9774025243]
Q7  BSS138W-7-F  [DIOD-SOT323-3_V]
R41  0402 JUMPER  [RESC1005X40X25ML05T05]  (value not drawn)
R42  0402 JUMPER  [RESC1005X40X25ML05T05]  (value not drawn)
R43  0402 JUMPER  [RESC1005X40X25ML05T05]  (value not drawn)
R44  330  [R0603B]
R45  100k  [R0603B]
R46  100k  [R0603B]
R47  1k  [R0603B]
R48  DNP  [R0603B]
R49  1k  [R0603B]
R50  1k  [R0603B]
R51  100k  [R0603B]
R175  1k  [R0603B]
R176  100k  [R0603B]
TP1  TPAD6R  [New footprint 1]  (value not drawn)
TP2  TPAD6R  [New footprint 1]  (value not drawn)
TP3  TPAD6R  [New footprint 1]  (value not drawn)
U31  AP22804AW5-7  [SOT95P285X140-5N]
Y2  ASDK-32.768KHZ-LRT  [FP-ASDK-MFG]

### Ports
nPCIE_CLKREQ (out, see HU_revC[10A]), nPCIE_RST (in, see HU_revC[10A]), nPCIE_WAKE (out, see HU_revC[10A]), PCIE_CLK_N (in, see HU_revC[10A], RPI_CM5_PINOUT[4C]), PCIE_CLK_P (in, see HU_revC[10A], RPI_CM5_PINOUT[4C]), PCIE_PWR_EN (in, see HU_revC[10A]), PCIE_RX0_N (out, see HU_revC[10A]), PCIE_RX0_P (out, see HU_revC[10A]), PCIE_TX0_N (in, see HU_revC[10A]), PCIE_TX0_P (in, see HU_revC[10A])

### Nets
3V3_LED: D4.2(A) D4.3(A)
3V3_M2: R48.2 U31.5(VIN)
3V3_M2_SF: C36.1 C37.1 C38.1 C39.1 C40.1 C41.1 C42.1 C43.1 C44.1 C45.1 J2.2 J2.4 J2.12 J2.14 J2.16 J2.18 J2.70 J2.72 J2.74 R45.1 R46.2 R175.1 U31.1(VOUT) Y2.1(Tri-state) Y2.4(Vdd)
GND: C36.2 C37.2 C38.2 C39.2 C40.2 C41.2 C42.2 C43.2 C44.2 C45.2 J2.1 J2.3 J2.9 J2.15 J2.21 J2.27 J2.33 J2.39 J2.45 J2.51 J2.57 J2.71 J2.73 J2.75 J2.76(MNT_1) J2.77(MNT_2) MP1.1 Q7.2(S) R51.1 R176.2 U31.2(GND) Y2.2(GND)
3V3_PCIE_nCLKREQ: R42.2 ; port nPCIE_CLKREQ
3V3_PCIE_nRST: R41.2 R46.1 ; port nPCIE_RST
3V3_PCIE_nWAKE: R43.2 ; port nPCIE_WAKE
3V3_PCIE_PWR_EN: R50.2 ; port PCIE_PWR_EN
M2_ACT_LED: J2.10 R49.2
M2_PCIE_TX0_N: C35.2 J2.49
M2_PCIE_TX0_P: C34.2 J2.47
M2_SMB_CLK: J2.40 TP1.1(TP)
M2_SMB_DATA: J2.42 TP2.1(TP)
M2_SMB_nALERT: J2.44 R45.2 TP3.1(TP)
M2_SUSCLK_32: R44.1 Y2.3(Output)
PCIE_CLK_N: J2.53 ; port PCIE_CLK_N
PCIE_CLK_P: J2.55 ; port PCIE_CLK_P
PCIE_RX_N: J2.43 ; port PCIE_RX0_N
PCIE_RX_P: J2.41 ; port PCIE_RX0_P
PCIE_TX_N: C35.1 ; port PCIE_TX0_N
PCIE_TX_P: C34.1 ; port PCIE_TX0_P
NetD4_1: D4.1(K) R47.1
NetD4_4: D4.4(K) R49.1
NetJ2_50: J2.50 R41.1
NetJ2_52: J2.52 R42.1
NetJ2_54: J2.54 R43.1
NetJ2_68: J2.68 R44.2
NetQ7_1: Q7.1(G) R175.2 R176.1
NetQ7_3: Q7.3(D) R47.2
NetR48_1: R48.1 R50.1 R51.2 U31.4(EN)

Not connected (* = marked no-connect by the designer): J2 5* 6* 7* 8* 11* 13* 17* 19* 20* 22* 23* 24* 25* 26* 28* 29* 30* 31* 32* 34* 35* 36* 37* 38* 46* 48* 56* 58* 67* 69*; U31 3(nFLG)*

### Layout directives
net class PWR: 3V3_M2_SF
differential pair; differential pair class 85DIFF: M2_PCIE_TX0_N, M2_PCIE_TX0_P

### Notes on the sheet
- M.2 KEY-M SLOT
- ROUTING GUIDELINES
  https://www.ti.com/lit/an/slaae45/slaae45.pdf
  Inter-pair skew up to 1m :)
  Intra-pair skew .15mm :(
- (near TP1) Idk if these will be useful but expose them
- PLACE AC CAPS CLOSE TO TX SIDE (CM5)
- STAT LED
- (near D4) FOR STATUS LED (0-3V3)
- (near R47) NOSTUFF
- POWER
- SUSCLK PROVIDER
- 3X 10uF
- 6X 0.1uF
- (near Y2) TIE HI
- MECH
- Place one 10uF and two 0.1uF per 'bank' of supply pins
- UNLABELLED RESISTORS ARE 0402 JUMPERS
- SCHEMATICS CHECKED - SEPT 25 2025
  - SUSCLK OK
  - M.2 PINOUT OK
  - LOAD SW OK
  - STANDOFF HEIGHT MATCHES CONN HEIGHT

### Library data of the parts
C34-C45 = CMP-001-00058-1: as C26 on sheet 5V0_REG; Min Operating Temperature: -55°C; Mounting Technology: Surface Mount; Pins: 2; Case/Package: 0402; RoHS Compliant: Yes; Max Operating Temperature: 85°C
D4 = CMP-004-00040-2: as D2 on sheet RPI_CM5_PINOUT; Source: rgled.SchLib; Component Type: Standard; Pins: 4; Design Item ID: CMP-004-00034-2
J2 = CMP-03365-000001-1: CONN EDGE DUAL FMALE 67POS 0.020; Manufacturer: TE; Number Of Contacts: 67; Current Rating: 0.5A; Pitch: 0.5mm; Conn Gender: Female; Is Female: yes; Voltage Rating: 50V; Conn Orientation: Right Angle; Automotive: No; Temperature Range High: +80°C; Package: 1-2199230-6; Category: Conn; Temperature: -40°C to +80°C; Number Of Rows: 2; ComponentLink2URL: http://www.te.com/commerce/DocumentDelivery/DDEController?Action=showdoc&DocId=Specification+Or+Standard%7F114-115006%7FB%7Fpdf%7FEnglish%7FENG_SS_114-115006_B_114-115006_REV_B.pdf%7F1-2199230-6; Manufacturer Part Number: 1-2199230-6; Height: 4.2mm; RoHS: TRUE; Footprint Url: http://www.te.com/commerce/DocumentDelivery/DDEController?Action=showdoc&DocId=Customer+Drawing%7F2199230%7FB2%7Fpdf%7FEnglish%7FENG_CD_2199230_B2.pdf%7F1-2199230-6; Digikey Description: CONN EDGE DUAL FMALE 67POS 0.020; Device Class L2: Card Edge Connectors; Contact Material: Gold,Tin; Device Class L1: Connectors; Device Class L3: unset; ComponentLink2Description: Datasheet; Temperature Range Low: -40°C; Octopart: https://octopart.com/1-2199230-6-te+connectivity-34969376; Lead Free: Yes
MP1 = CMP-03913-59774857-1: 9774025243R Spacer Material: Steel, Tin-Plated Mounting: SMT Series: WA-SMST Thread D: M2; Outside Diameter: 4.3434mm; Threaded/Unthreaded: Threaded; Plating: Tin; REACH SVHC: Unknown; NexarPartId: 59774857; RoHS: Compliant; Material: Steel; Packaging: Tape and Reel; Max Operating Temperature: 150°C; Min Operating Temperature: -55°C; Length: 2.5mm; Height: 2.5mm
Q7 = CMP-2000-05968-1: N-Channel Enhancement Mode Mosfet, 50 V, 200 mA, -55 to 150 degC, 6-Pin SOT-323, RoHS, Tape and Reel; Typical Turn-Off Delay Time: 20ns; Number of Channels: 1Channel; Type: EnhancementModeFieldEffectTransistor; Brand: DiodesIncorporated; Vds - Drain-Source Breakdown Voltage: 75V; Vgs - Gate-Source Voltage: 20V; Rds On - Drain-Source Resistance: 1.4Ohms; Transistor Type: 1N-Channel; Configuration: Single; Unit Weight: 0.000212oz; Pd - Power Dissipation: 200mW; Id - Continuous Drain Current: 200mA; Forward Transconductance - Min: 0.1S; Manufacturer URL: http://www.diodes.com/; Series: BSS138; Package Description: 3-Pin Small Outline Transistor, Body 2 x 1.25 mm, Pitch 0.65 mm; Mounting Technology: SurfaceMount; Product Category: MOSFET; RoHS: True; Maximum Operating Temperature: +150C; Height: 1mm; Length: 2.2mm; Technology: Si; Width: 1.35mm; Datasheet URL: http://www.diodes.com/_files/datasheets/ds30206.pdf; Manufacturer: DiodesIncorporated; Package / Case: SOT-323-3; Typical Turn-On Delay Time: 20ns; Transistor Polarity: N-Channel; Factory Pack Quantity: 3000; Packaging: Reel; Product: MOSFETSmallSignal; Datasheet Version: Rev. 11-2, 09/2013; Package Reference: SOT323; Minimum Operating Temperature: -55C; Mounting Style: SMD/SMT; Channel Mode: Enhancement
R41-R43 = CMP-009-00118-2: READ THE NAME; Pins: 2; Component Type: Standard; Design Item ID: CMP-009-00206-2; Source: 0402jump.SchLib
R44-R51 R175 R176 = CMP-009-00002-14: Resistor
  R44: Value: 330
  R45 R46 R51 R176: Value: 100k
  R47 R49 R50 R175: Value: 1k
  R48: Value: DNP
TP1-TP3 = CMP-00025-2: Test Point .6mm
U31 = CMP-019-00060-1: SINGLE CHANNEL POWER DISTRIBUTION LOAD SWITCH, -40 to 85°C pF, RoHS; Max Supply Voltage: 5.5V; Min Supply Voltage: 2.7V; Max Operating Temperature: 85°C; Min Operating Temperature: -40°C
Y2 = CMP-27762-001115-1: XTAL OSC XO 32.7680KHZ CMOS SMD; Load Capacitance: 15pF; Max Supply Current: 3.5mA; Min Supply Voltage: 2.97V; Operating Supply Voltage: 3.3V; Frequency Stability: 25ppm; Lead Free: Lead Free; Case/Package: CSMD; Number of Pins: 4; Max Operating Temperature: 85°C; Packaging: Tape and Reel; Width: 0.079inch; Min Operating Temperature: -40°C; Radiation Hardening: No; Length: 2.5mm; Depth: 2mm; Termination: SMD/SMT; Height: 0.037inch; Series: ASDK; Frequency: 32.768kHz; Mount: Surface Mount

## Sheet MCP2515_PINOUT.SchDoc
size A; SheetNumber: 6; SheetTotal: 21
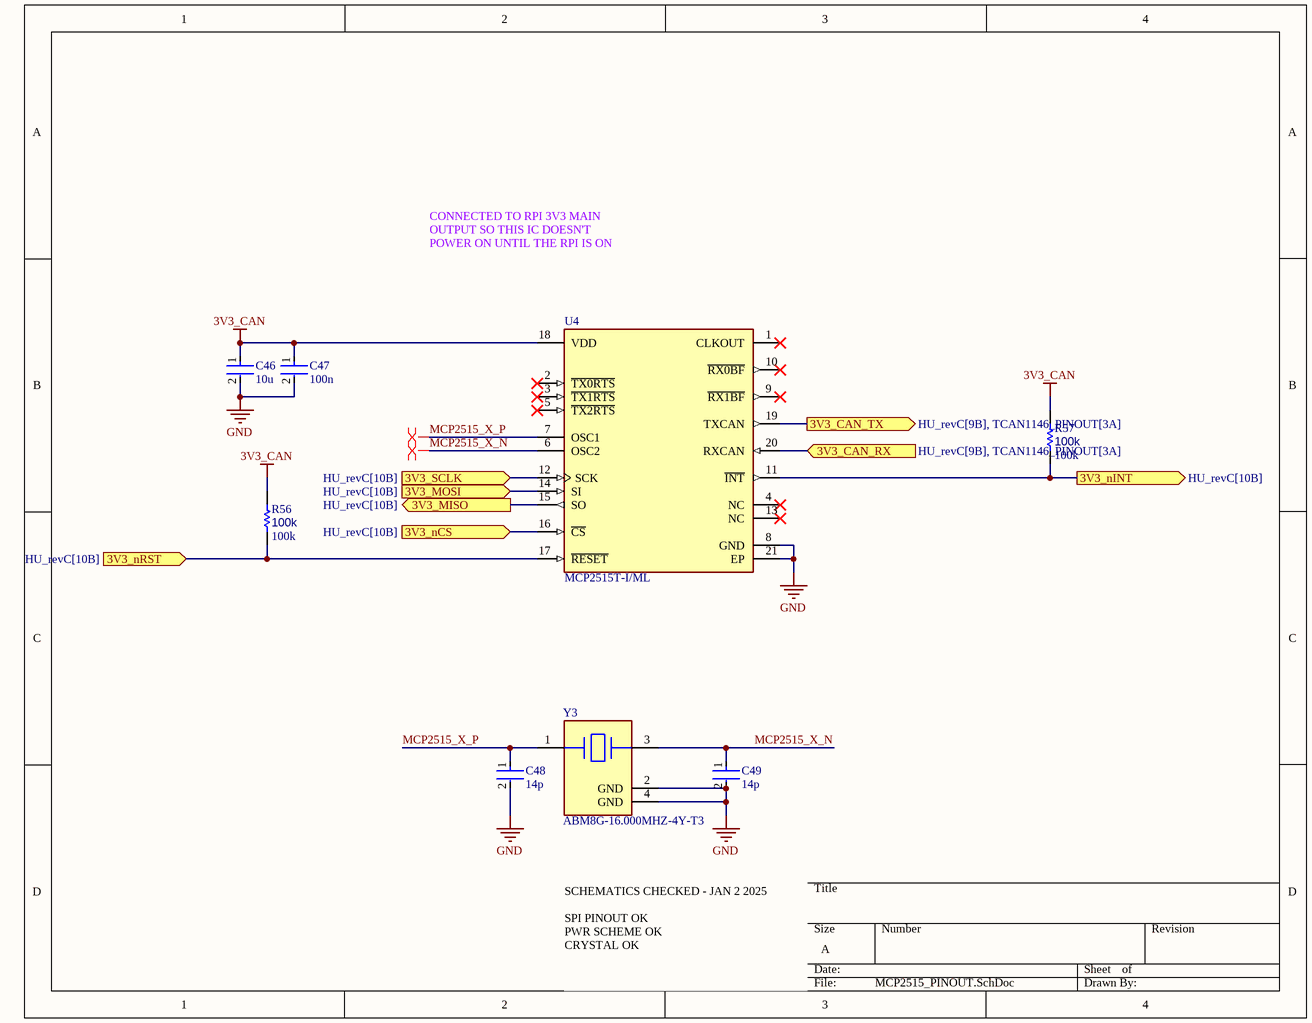
[diagram p10: MCP2515_PINOUT.SchDoc]

### Parts
C46  10u  [FP-0402-L_1_0_0_05-W_0_5-IPC_A]
C47  100n  [FP-0402-L_1_0_0_05-W_0_5-IPC_A]
C48  14p  [FP-0402-L_1_0_0_05-W_0_5-IPC_A]
C49  14p  [FP-0402-L_1_0_0_05-W_0_5-IPC_A]
R56  100k  [R0603B]
R57  100k  [R0603B]
U4  MCP2515T-I/ML  [FP-C04-126-MFG]
Y3  ABM8G-16.000MHZ-4Y-T3  [FP-ABM8G-MFG]

### Ports
3V3_CAN_RX (in, see HU_revC[9B], TCAN1146_PINOUT[3A]), 3V3_CAN_TX (out, see HU_revC[9B], TCAN1146_PINOUT[3A]), 3V3_MISO (out, see HU_revC[10B]), 3V3_MOSI (in, see HU_revC[10B]), 3V3_nCS (in, see HU_revC[10B]), 3V3_nINT (out, see HU_revC[10B]), 3V3_nRST (in, see HU_revC[10B]), 3V3_SCLK (in, see HU_revC[10B])

### Nets
3V3_CAN: C46.1 C47.1 R56.1 R57.1 U4.18(VDD)
GND: C46.2 C47.2 C48.2 C49.2 U4.8(GND) U4.21(EP) Y3.2(GND) Y3.4(GND)
3V3_CAN_RX: U4.20(RXCAN) ; port 3V3_CAN_RX
3V3_CAN_TX: U4.19(TXCAN) ; port 3V3_CAN_TX
3V3_SPI1_MISO (GPIO19): U4.15(SO) ; port 3V3_MISO
3V3_SPI1_MOSI (GPIO20): U4.14(SI) ; port 3V3_MOSI
3V3_SPI1_nCS0 (GPIO18): U4.16(~{CS}) ; port 3V3_nCS
3V3_SPI1_SCLK (GPIO21): U4.12(SCK) ; port 3V3_SCLK
MCP2515_X_N: C49.1 U4.6(OSC2) Y3.3
MCP2515_X_P: C48.1 U4.7(OSC1) Y3.1
NetR56_2: R56.2 U4.17(~{RESET}) ; port 3V3_nRST
NetR57_2: R57.2 U4.11(~{INT}) ; port 3V3_nINT

Not connected (* = marked no-connect by the designer): U4 1(CLKOUT)* 2(~{TX0RTS})* 3(~{TX1RTS})* 4(NC)* 5(~{TX2RTS})* 9(~{RX1BF})* 10(~{RX0BF})* 13(NC)*

### Layout directives
differential pair: MCP2515_X_N, MCP2515_X_P

### Notes on the sheet
- CONNECTED TO RPI 3V3 MAIN OUTPUT SO THIS IC DOESN'T POWER ON UNTIL THE RPI IS ON
- SCHEMATICS CHECKED - JAN 2 2025
  SPI PINOUT OK
  PWR SCHEME OK
  CRYSTAL OK

### Library data of the parts
C46-C49 = CMP-001-00058-1: as C26 on sheet 5V0_REG; Min Operating Temperature: -55°C; Mounting Technology: Surface Mount; Pins: 2; Case/Package: 0402; RoHS Compliant: Yes; Max Operating Temperature: 85°C
R56 R57 = CMP-009-00002-14: Resistor; Value: 100k
U4 = CMP-0186-00186-2: IC CAN CTLR W/SPI 2.0B 20-QFN; Max Supply Voltage: 5.5V; Max Supply Current: 10mA; Number of Transceivers: 1; Min Supply Voltage: 2.7V; Data Rate: 1000Kbps; Interface: SPI; Mount: Surface Mount; Packaging: Tape and Reel; Lead Free: Lead Free; Package Quantity: 3300; Case/Package: QFN; Max Operating Temperature: 85°C; Number of Pins: 20; Min Operating Temperature: -40°C; Contact Plating: Tin; Radiation Hardening: No; Nominal Supply Current: 10mA
Y3 = CMP-27762-015134-1: Crystal 16MHz ±30ppm (Tol) ±30ppm (Stability) 10pF FUND 80Ω 4-Pin SMD T/R; Series Resistance: 80R; Mount: Surface Mount; Width: 0.098inch; Load Capacitance: 10pF; Length: 3.2mm; Series: ABM8G; Max Operating Temperature: 60°C; Depth: 2.5mm; Frequency: 16MHz; Frequency Tolerance: 30ppm; Height: 0.039inch; ESR (Equivalent Series Resistance): 80R; Case/Package: SMD/SMT; Lead Free: Lead Free; Frequency Stability: 30ppm; Packaging: Tape and Reel; Number of Pins: 4; REACH SVHC: No SVHC; Min Operating Temperature: -10°C

## Sheet ADC108S022_PINOUT.SchDoc
size A; SheetNumber: 7; SheetTotal: 21
Used 2 times, as channels ADC_0, ADC_1. Parts and nets are listed once, with the designators drawn on the sheet.
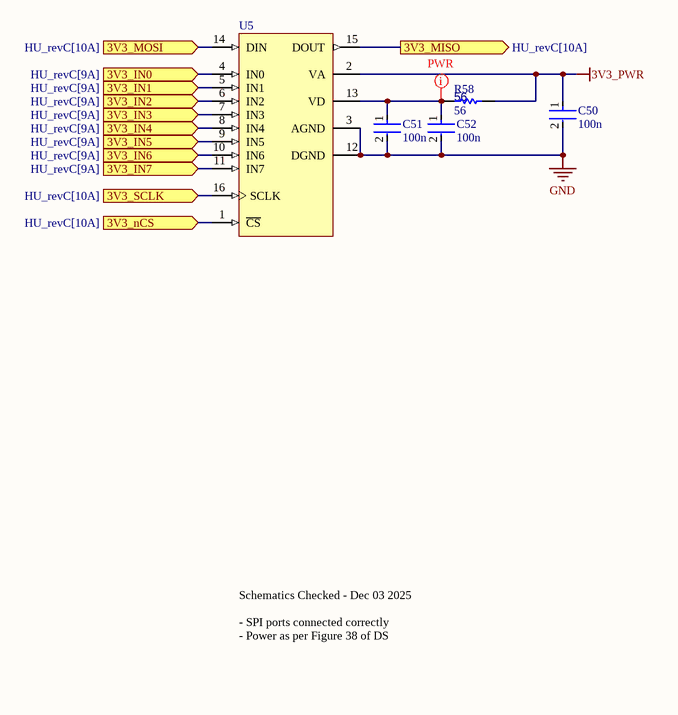
[diagram p11: ADC108S022_PINOUT.SchDoc]

### Parts
C50  100n  [FP-0402-L_1_0_0_05-W_0_5-IPC_A]
C51  100n  [FP-0402-L_1_0_0_05-W_0_5-IPC_A]
C52  100n  [FP-0402-L_1_0_0_05-W_0_5-IPC_A]
R58  56  [R0603B]
U5  (no value)  [MTC16_L]

### Ports
3V3_IN0 (in, see HU_revC[9A]), 3V3_IN1 (in, see HU_revC[9A]), 3V3_IN2 (in, see HU_revC[9A]), 3V3_IN3 (in, see HU_revC[9A]), 3V3_IN4 (in, see HU_revC[9A]), 3V3_IN5 (in, see HU_revC[9A]), 3V3_IN6 (in, see HU_revC[9A]), 3V3_IN7 (in, see HU_revC[9A]), 3V3_MISO (out, see HU_revC[10A]), 3V3_MOSI (in, see HU_revC[10A]), 3V3_nCS (in, see HU_revC[10A]), 3V3_SCLK (in, see HU_revC[10A])

### Nets
3V3_PWR: C50.1 R58.1 U5.2(VA)
GND: C50.2 C51.2 C52.2 U5.3(AGND) U5.12(DGND)
3V3_IN0: U5.4(IN0) ; port 3V3_IN0
3V3_IN1: U5.5(IN1) ; port 3V3_IN1
3V3_IN2: U5.6(IN2) ; port 3V3_IN2
3V3_IN3: U5.7(IN3) ; port 3V3_IN3
3V3_IN4: U5.8(IN4) ; port 3V3_IN4
3V3_IN5: U5.9(IN5) ; port 3V3_IN5
3V3_IN6: U5.10(IN6) ; port 3V3_IN6
3V3_IN7: U5.11(IN7) ; port 3V3_IN7
3V3_MISO: U5.15(DOUT) ; port 3V3_MISO
3V3_MOSI: U5.14(DIN) ; port 3V3_MOSI
3V3_nCS: U5.1(~{CS}) ; port 3V3_nCS
3V3_SCLK: U5.16(SCLK) ; port 3V3_SCLK
NetC51_1: C51.1 C52.1 R58.2 U5.13(VD)

### Channels
ADC_0: designators end in _ADC_0; ports 3V3_IN0=3V3_INPUT_V_SENSE 3V3_IN1=3V3_AMP_I_SENSE 3V3_IN2=3V3_INPUT_I_SENSE 3V3_IN3=3V3_CAR_VCC_V_SENSE 3V3_IN4=3V3_CAR_VCC_I_SENSE 3V3_IN5=3V3_CAR_APM_V_SENSE 3V3_IN6=3V3_CAR_APM_I_SENSE 3V3_IN7=3V3_12V_VCC_I_SENSE 3V3_MISO=3V3_SPI0_MISO (GPIO9) 3V3_MOSI=3V3_SPI0_MOSI (GPIO10) 3V3_nCS=3V3_SPI0_nCS0 (GPIO8) 3V3_SCLK=3V3_SPI0_SCLK (GPIO11)
ADC_1: designators end in _ADC_1; ports 3V3_IN0=3V3_5V0_MAIN_T_SENSE 3V3_IN1=3V3_5V0_VCC_I_SENSE 3V3_IN2=AMBIENT_TEMP 3V3_IN3=NetU5_ADC_1_7 3V3_IN4=3V3_3V3_VCC_I_SENSE 3V3_IN5=3V3_3V3_MAIN_V_SENSE 3V3_IN6=3V3_5V0_MAIN_V_SENSE 3V3_IN7=3V3_3V3_MAIN_T_SENSE 3V3_MISO=3V3_SPI0_MISO (GPIO9) 3V3_MOSI=3V3_SPI0_MOSI (GPIO10) 3V3_nCS=3V3_SPI0_nCS2 (GPIO3) 3V3_SCLK=3V3_SPI0_SCLK (GPIO11)

### Layout directives
net class PWR: NetC51_ADC_0_1

### Notes on the sheet
- Schematics Checked - Dec 03 2025
  - SPI ports connected correctly
  - Power as per Figure 38 of DS

### Library data of the parts
C50-C52 = CMP-001-00058-1: as C26 on sheet 5V0_REG; Min Operating Temperature: -55°C; Mounting Technology: Surface Mount; Pins: 2; Case/Package: 0402; RoHS Compliant: Yes; Max Operating Temperature: 85°C
R58 = CMP-009-00002-14: Resistor; Value: 56
U5 = CMP-0054-00372-2: 8-Channel, 50 kSPS to 200 kSPS, 8-Bit A/D Converter, 16-pin TSSOP, Pb-Free; Manufacturer: National Semiconductor; PackageTopMarking: NSUZXYTT*88S022*CIMT; CompType: ADC IC; PowerWise: Y; ComponentLink2URL: http://www.national.com/pf/AD/ADC088S022.html; RoHS: Y; PackageDescription: Molded TSSOP, Jedec, 5 x 4.4 x 0.9mm Body, 16 Lead, 0.65mm Pitch; DatasheetVersion: Feb-2010; PinCount: 16; ComponentLink1Description: ADC088S022 Datasheet; Code_JEDEC: MO-153-AB; ComponentLink3URL: http://www.national.com/packaging/folders/mtc16.html; PackageVersion: revD, Jun-2003; ComponentLink3Description: MTC16 Package Page; RevisionNote: Component URLs added; ComponentLink1URL: http://www.national.com/ds/AD/ADC088S022.pdf; ComponentLink2Description: ADC088S022 Web Page; PackageReference: MTC16

## Sheet 3V3_REG.SchDoc
size B; SheetNumber: 9; SheetTotal: 20
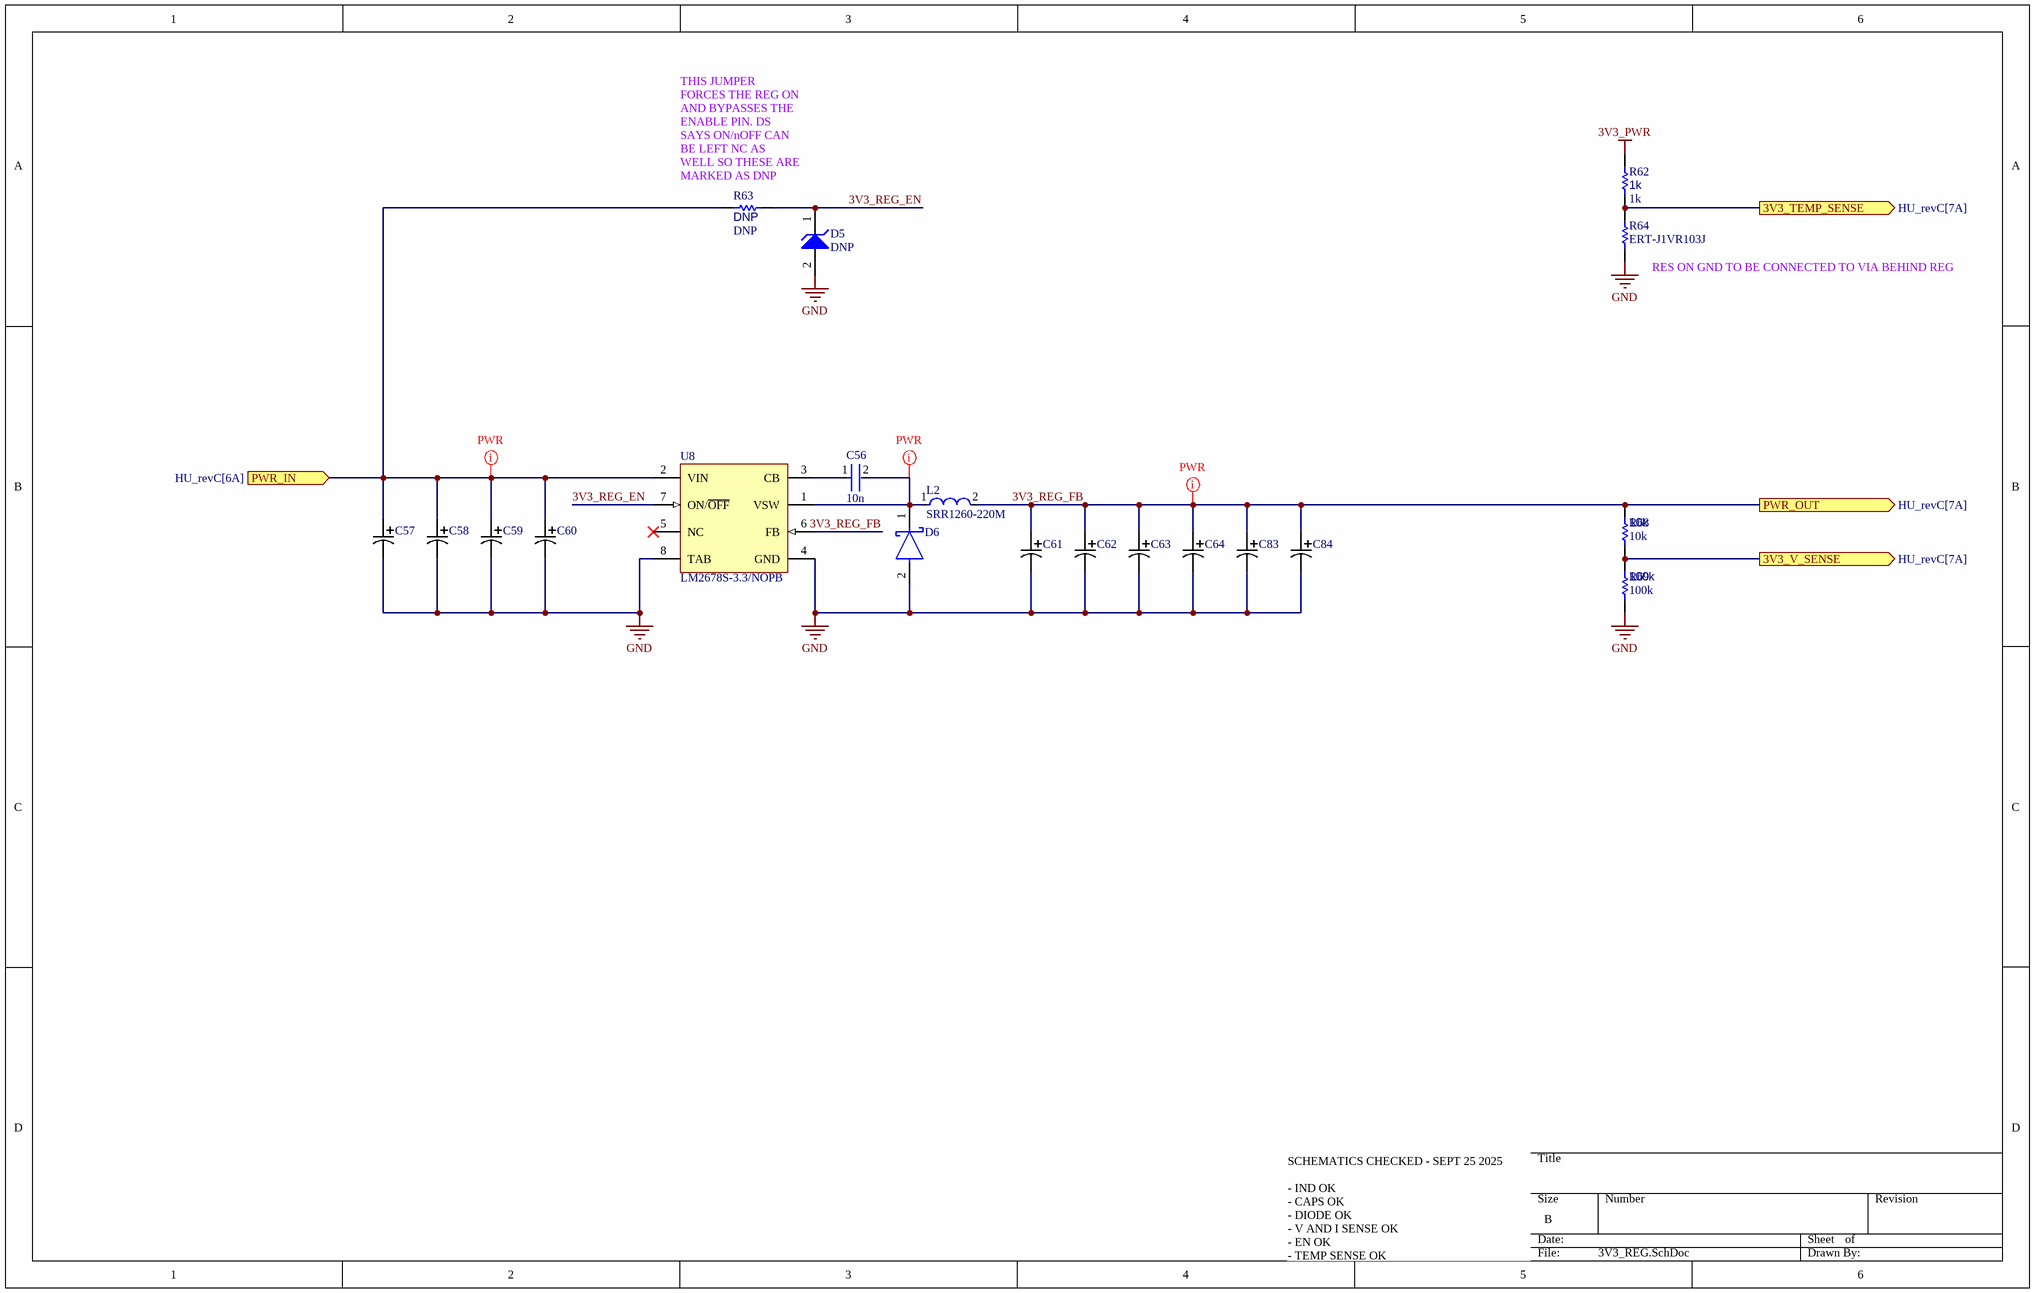
[diagram p12: 3V3_REG.SchDoc]

### Parts
C56  10n  [FP-0402-L_1_0_0_05-W_0_5-IPC_A]
C57  T495D475K050ATE300  [T495D475K050ATE300-Footprint-1]  (value not drawn)
C58  T495D475K050ATE300  [T495D475K050ATE300-Footprint-1]  (value not drawn)
C59  T495D475K050ATE300  [T495D475K050ATE300-Footprint-1]  (value not drawn)
C60  T495D475K050ATE300  [T495D475K050ATE300-Footprint-1]  (value not drawn)
C61  T495X107K020ATE150  [T495D337K010ATE150-Footprint-1]  (value not drawn)
C62  T495X107K020ATE150  [T495D337K010ATE150-Footprint-1]  (value not drawn)
C63  T495X107K020ATE150  [T495D337K010ATE150-Footprint-1]  (value not drawn)
C64  DNP  [T495D337K010ATE150-Footprint-1]  (value not drawn)
C83  DNP  [T495D337K010ATE150-Footprint-1]  (value not drawn)
C84  DNP  [T495D337K010ATE150-Footprint-1]  (value not drawn)
D5  DNP  [ONSC-SOD-523-2-502-01_V]
D6  B540C-13-F  [FP-SMC-MFG]  (value not drawn)
L2  SRR1260-220M  [FP-SRR1260-MFG]
R62  1k  [R0603B]
R63  DNP  [R0603B]
R64  ERT-J1VR103J  [RESC1608X90X30ML15T20]
R68  10k  [R0603B]
R69  100k  [R0603B]
U8  LM2678S-3.3/NOPB  [KTW0007B_N]

### Ports
3V3_TEMP_SENSE (out, see HU_revC[7A]), 3V3_V_SENSE (out, see HU_revC[7A]), PWR_IN (in, see HU_revC[6A]), PWR_OUT (out, see HU_revC[7A])

### Nets
3V3_PWR: R62.1
3V3_REG_FB: C61.1 C62.1 C63.1 C64.1 C83.1 C84.1 L2.2 R68.2 U8.6(FB) ; port PWR_OUT
GND: C57.2 C58.2 C59.2 C60.2 C61.2 C62.2 C63.2 C64.2 C83.2 C84.2 D5.2(A) D6.2(A) R64.1 R69.1 U8.4(GND) U8.8(TAB)
3V3_3V3_MAIN_T_SENSE: R62.2 R64.2 ; port 3V3_TEMP_SENSE
3V3_3V3_MAIN_V_SENSE: R68.1 R69.2 ; port 3V3_V_SENSE
3V3_REG_EN: D5.1(K) R63.2 U8.7(ON/~{OFF})
NetC56_1: C56.1 U8.3(CB)
NetC56_2: C56.2 D6.1(C) L2.1 U8.1(VSW)
NetC57_1: C57.1 C58.1 C59.1 C60.1 R63.1 U8.2(VIN) ; port PWR_IN

Not connected (* = marked no-connect by the designer): U8 5(NC)*

### Layout directives
net class PWR: 3V3_REG_FB, NetC56_2, NetC57_1

### Notes on the sheet
- (near R63) THIS JUMPER FORCES THE REG ON AND BYPASSES THE ENABLE PIN. DS SAYS ON/nOFF CAN BE LEFT NC AS WELL SO THESE ARE MARKED AS DNP
- (near R64) RES ON GND TO BE CONNECTED TO VIA BEHIND REG
- SCHEMATICS CHECKED - SEPT 25 2025
  - IND OK
  - CAPS OK
  - DIODE OK
  - V AND I SENSE OK
  - EN OK
  - TEMP SENSE OK

### Library data of the parts
C56 = CMP-001-00058-1: as C26 on sheet 5V0_REG; Min Operating Temperature: -55°C; Mounting Technology: Surface Mount; Pins: 2; Case/Package: 0402; RoHS Compliant: Yes; Max Operating Temperature: 85°C
C57-C60 = CMP-001-00066-2: Cap Tant Solid 4.7uF 50V D CASE 10% (7.3 X 4.3 X 2.8mm) SMD 7343-31 0.3 Ohm 125 C T/R; Value: 4.7µF; Min Operating Temperature: -55°C; Voltage Rating: 50V; Tolerance: 10%; Mounting Technology: Surface Mount; Max Operating Temperature: 125°C; Case/Package: 7343-31; Pins: 2
C61-C63 C83 = CMP-001-00067-2: as C85 on sheet 5V0_REG; Case/Package: 2917; Min Operating Temperature: -55°C; Mounting Technology: Surface Mount; Max Operating Temperature: 125°C
C64 C84 = CMP-001-00067-2: Tolerance: 10%; Voltage Rating: 10V; Value: 330µF; Case/Package: 2917; Min Operating Temperature: -55°C; Mounting Technology: Surface Mount; Max Operating Temperature: 125°C
D5 = CMP-1060-00750-1: Zener Voltage Regulator, 500 mW, 2-Pin SOD-523, Pb-Free, Tape and Reel; Manufacturer: On Semiconductor; PartNumber: MM5Z3V3T1G; P Max (W): 0.5; VZ Typ (V): 3.3; RoHS: Pb-Free; ComponentLink2Description: Datasheet; PackageReference: SOD-523-2-502-01; DatasheetVersion: Rev. 10; ComponentLink1Description: Manufacturer URL; PackageVersion: Rev. E, 09/2010; ComponentLink3URL: http://www.onsemi.com/pub_link/Collateral/502-01.PDF; ComponentLink2URL: http://www.onsemi.cn/pub_link/Collateral/MM5Z2V4T1-D.PDF; Mounting Technology: Surface Mount; Packing: Tape and Reel; PackageDescription: 2-Pin SOD, Body 1.2 x 0.8 mm; ComponentLink1URL: http://www.onsemi.com/; ComponentLink3Description: Package Specification
D6 = CMP-2000-05097-3: DIODE SCHOTTKY 40V 5A SMC; Manufacturer: Diodes Inc.; Automotive Grade: NA; Peak Reverse Current: 0.5mA; Value: 300pF; Max Junction Temp: +150°C; Max Surge Forward Current: 100A; Standoff Height: 0.1mm; Digikey Description: DIODE SCHOTTKY 40V 5A SMC; Temperature Range Low: -55°C; Manufacturer Part Number: B540C-13-F; Octopart: https://octopart.com/b540c-13-f-diodes+inc.-325873; Lead Free: Yes; Reverse Voltage: 40V; RoHS: TRUE; Category: Diode; Mouser Description: Diode: Schottky rectifying; SMD; 40V; 5A; SMC; Package: reel, tape; ComponentLink2Description: Datasheet; Temperature Range High: +150°C; Automotive: No; Footprint Url: https://www.diodes.com/assets/Package-Files/SMC.pdf; Device Class L3: Schottky Diodes; Height: 2.5mm; Forward Current: 5A; Temperature: -55°C to +150°C; Package: SMC; ComponentLink2URL: https://www.diodes.com/assets/Datasheets/ds13012.pdf; Device Class L2: Diodes; Max Repetitive Reverse Voltage: 40V; Device Class L1: Discrete Semiconductors; Capacitance: 300pF
L2 = CMP-2000-07146-2: DIFF P/N: SRR1260-220M / FIXED IND 22UH 5A 27 MOHM SMD; Q Factor: 25; Sample Rate (Hz): 100kHz; Resistance: 27MR; Material: Steel; Inductance Tolerance: 20%; Inductance: 15uH; Frequency: 17.6MHz; Saturation Current: 4.6A; Core Material: Ferrite; Shielding: Shielded; Series: SRR1260; Termination: SMD/SMT; Packaging: Tape and Reel; RoHS Compliant: Yes; Height - Seated (Max): 0.256inch; Depth: 12.8mm; Case/Package: 1260; Height: 6mm; Number of Pins: 2; Mount: Surface Mount; Min Operating Temperature: -40°C; Test Frequency: 100kHz; Length: 12.5mm; Self Resonant Frequency: 17.6MHz; Current Rating: 5A; Tolerance: 20%; RMS Current (Irms): 5A; REACH SVHC: No SVHC; Resistor Type: Wirewound; DC Resistance (DCR): 27mR; Width: 12.5mm; Package Quantity: 600; DC Current: 5A; Max DC Current: 5A; Max Operating Temperature: 125°C; Military Standard: Not
R62 R63 R68 R69 = CMP-009-00002-14: Resistor
  R62: Value: 1k
  R63: Value: DNP
  R68: Value: 10k
  R69: Value: 100k
R64 = CMP-2000-00869-1: Manufacturer: Panasonic; Part Number: ERT-J1VR103J
U8 = CMP-0069-00195-3: SIMPLE SWITCHER® High Efficiency 5A Step-Down Voltage Regulator, 7-pin TO-263, Pb-Free; Manufacturer: Texas Instruments; PackageTopMarking: NSUZXYTTE#*LM2678*S-3.3; PowerWise: N; PackageReference: KTW0007B; Code_JEDEC: MO-169-AC; CompType: Switcher; RoHS: Y; PackageDescription: TO-263, Molded, .400 x .390 x .180in Body, 7 Lead, .050in Pitch, Surface Mount; ComponentLink1Description: Datasheet URL; PinCount: 7; ComponentLink1URL: http://www.ti.com/general/docs/lit/getliterature.tsp?genericPartNumber=LM2678&fileType=pdf